# EAGLE design interface (EAGLE 9.6.2)

## Sheet 1 of 3: TITLE
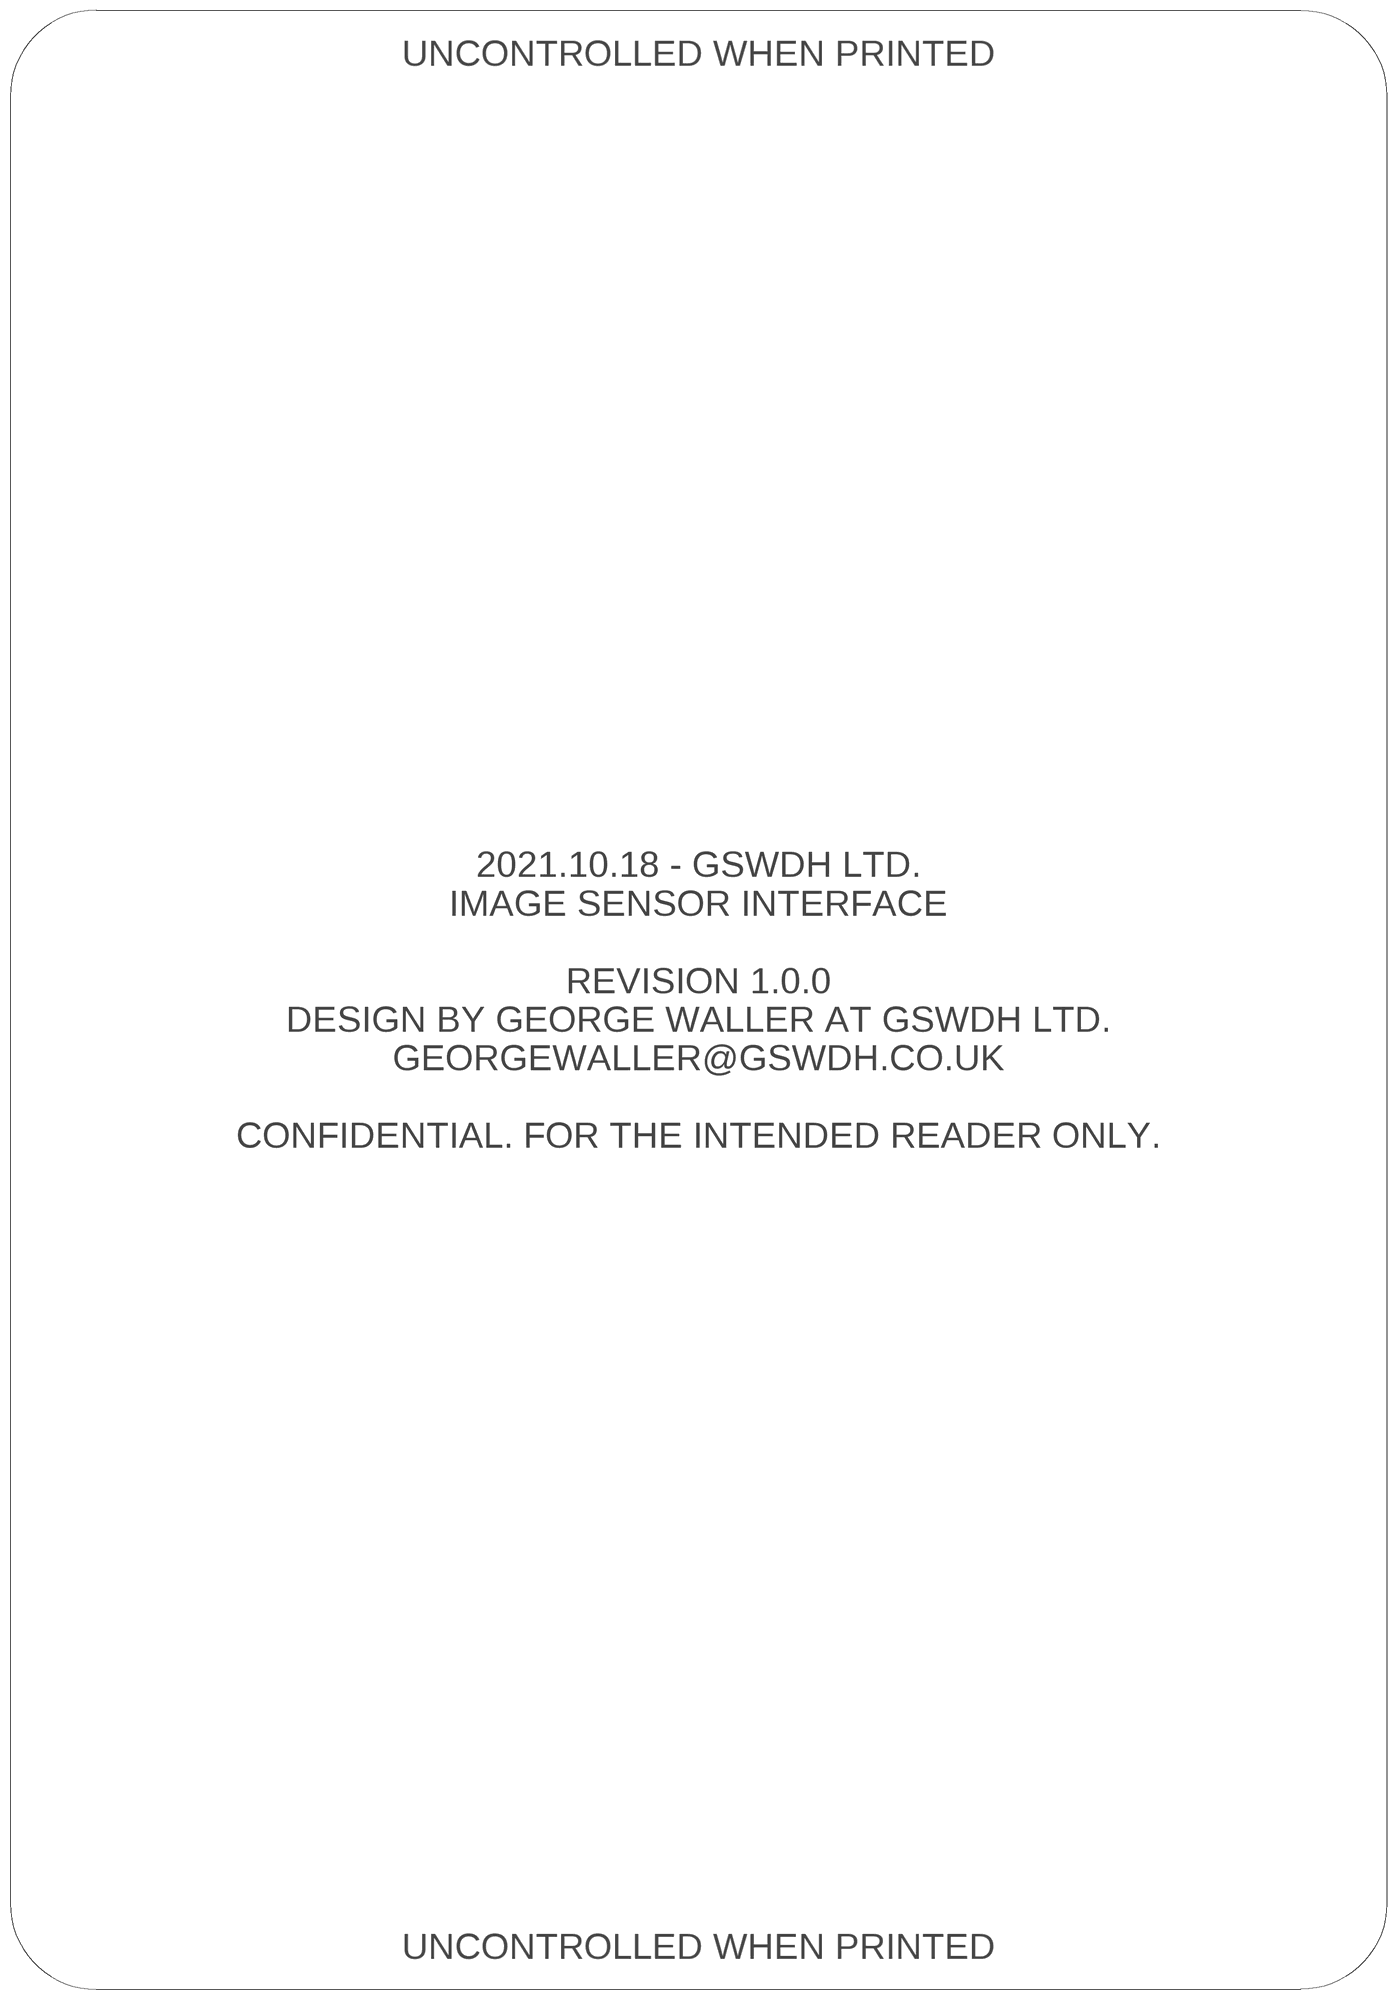
[diagram p0: schematic, sheet 1]

### Notes on the sheet
- UNCONTROLLED WHEN PRINTED
- 2021.10.18 - GSWDH LTD.
  IMAGE SENSOR INTERFACE
  
  REVISION 1.0.0
  DESIGN BY GEORGE WALLER AT GSWDH LTD.
  GEORGEWALLER@GSWDH.CO.UK
  
  CONFIDENTIAL. FOR THE INTENDED READER ONLY.
- UNCONTROLLED WHEN PRINTED

## Sheet 2 of 3: SENSOR
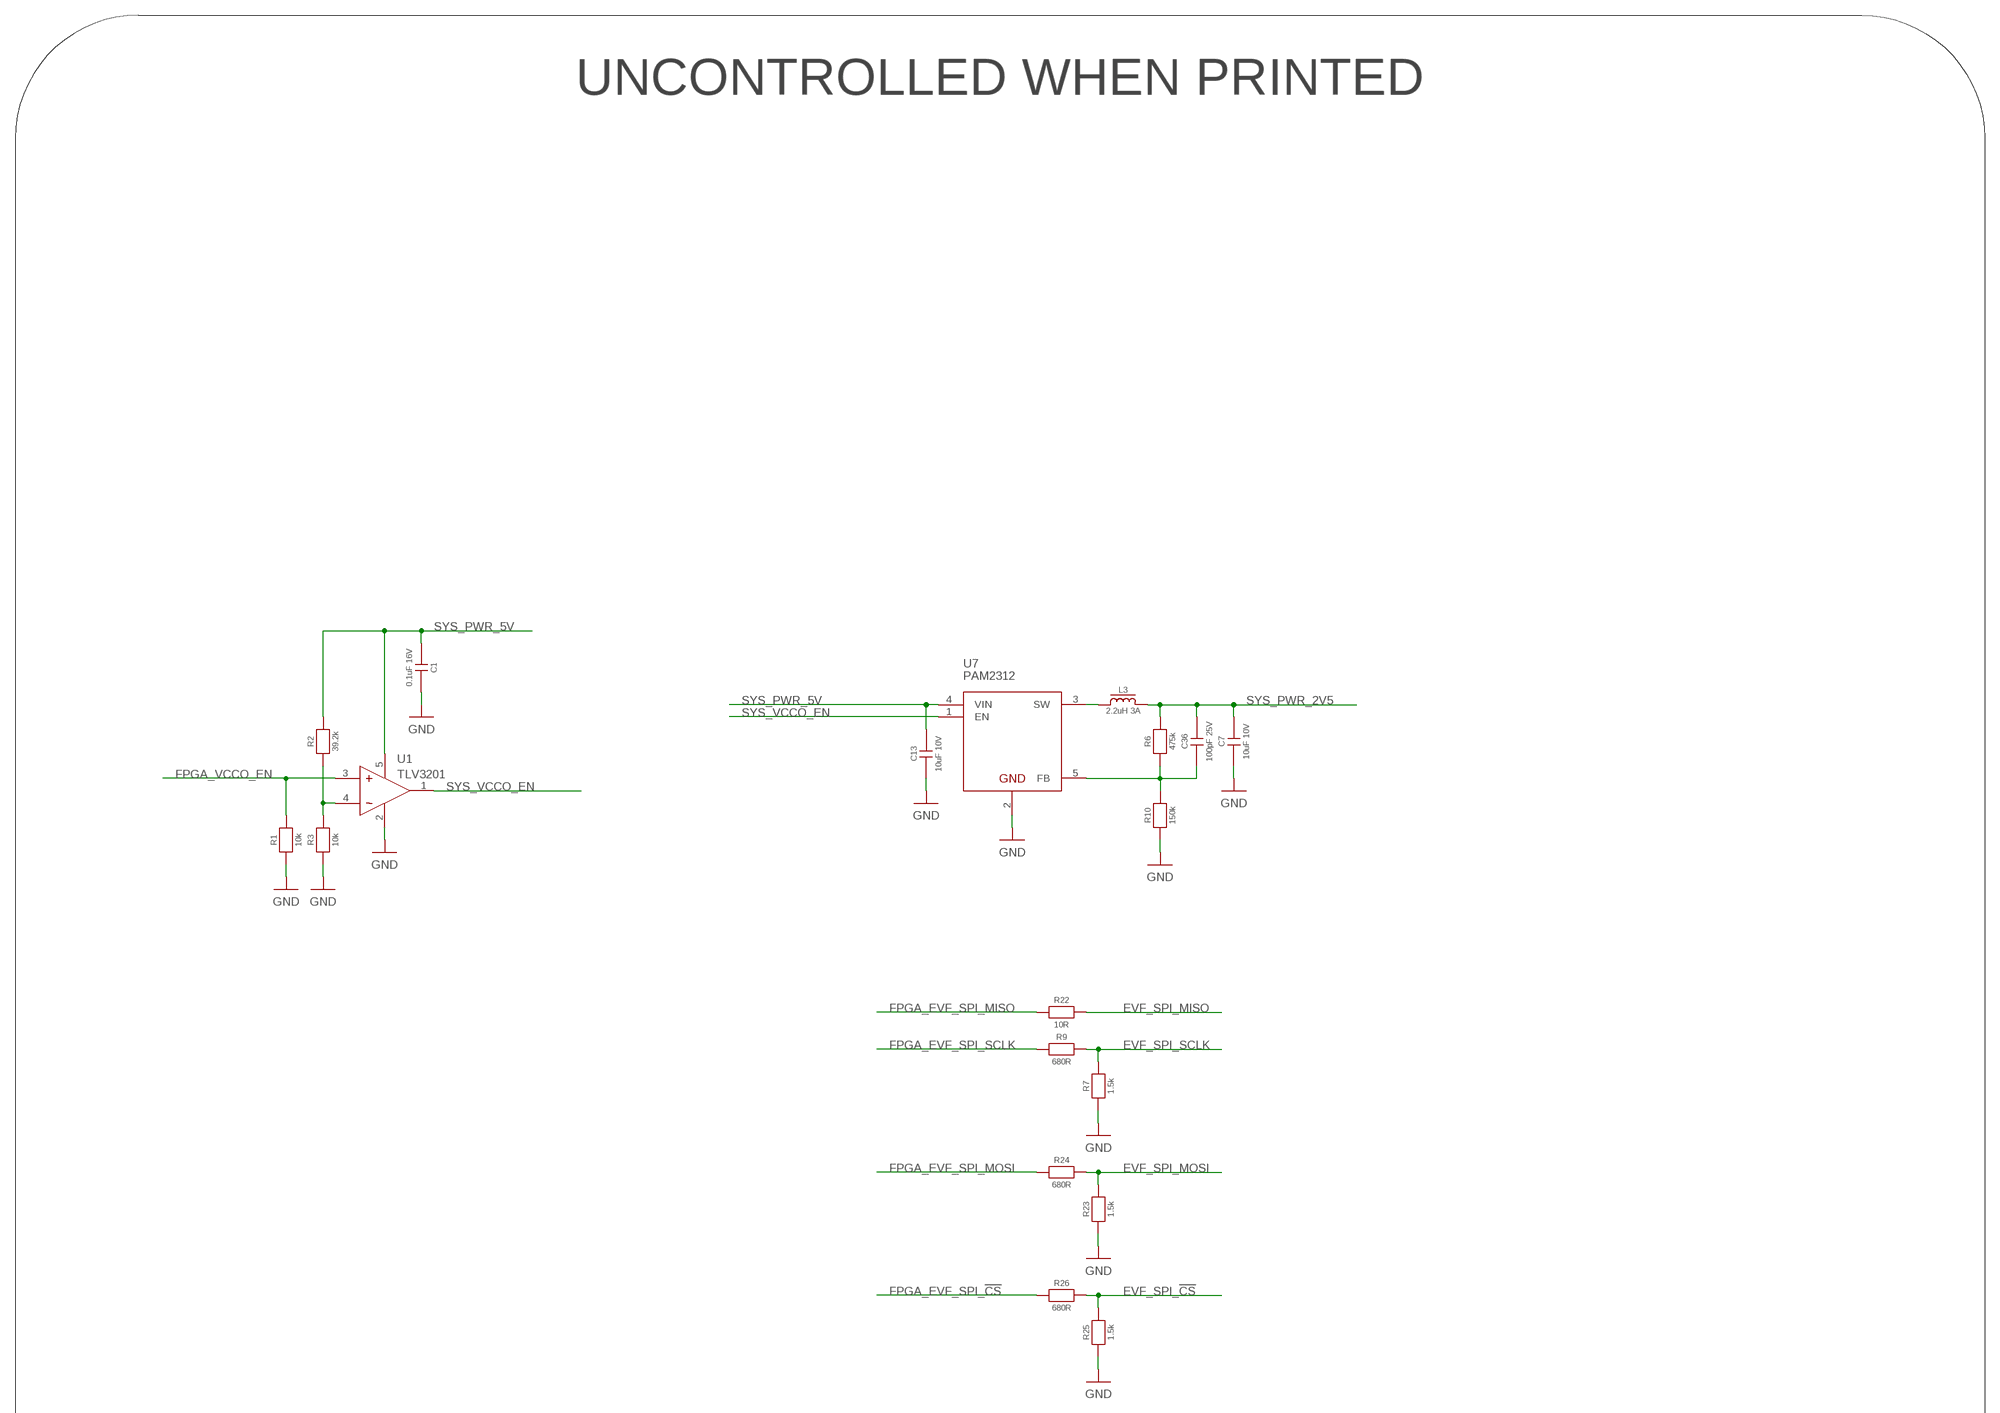
[diagram p1: schematic, sheet 2, part 1 of 2]
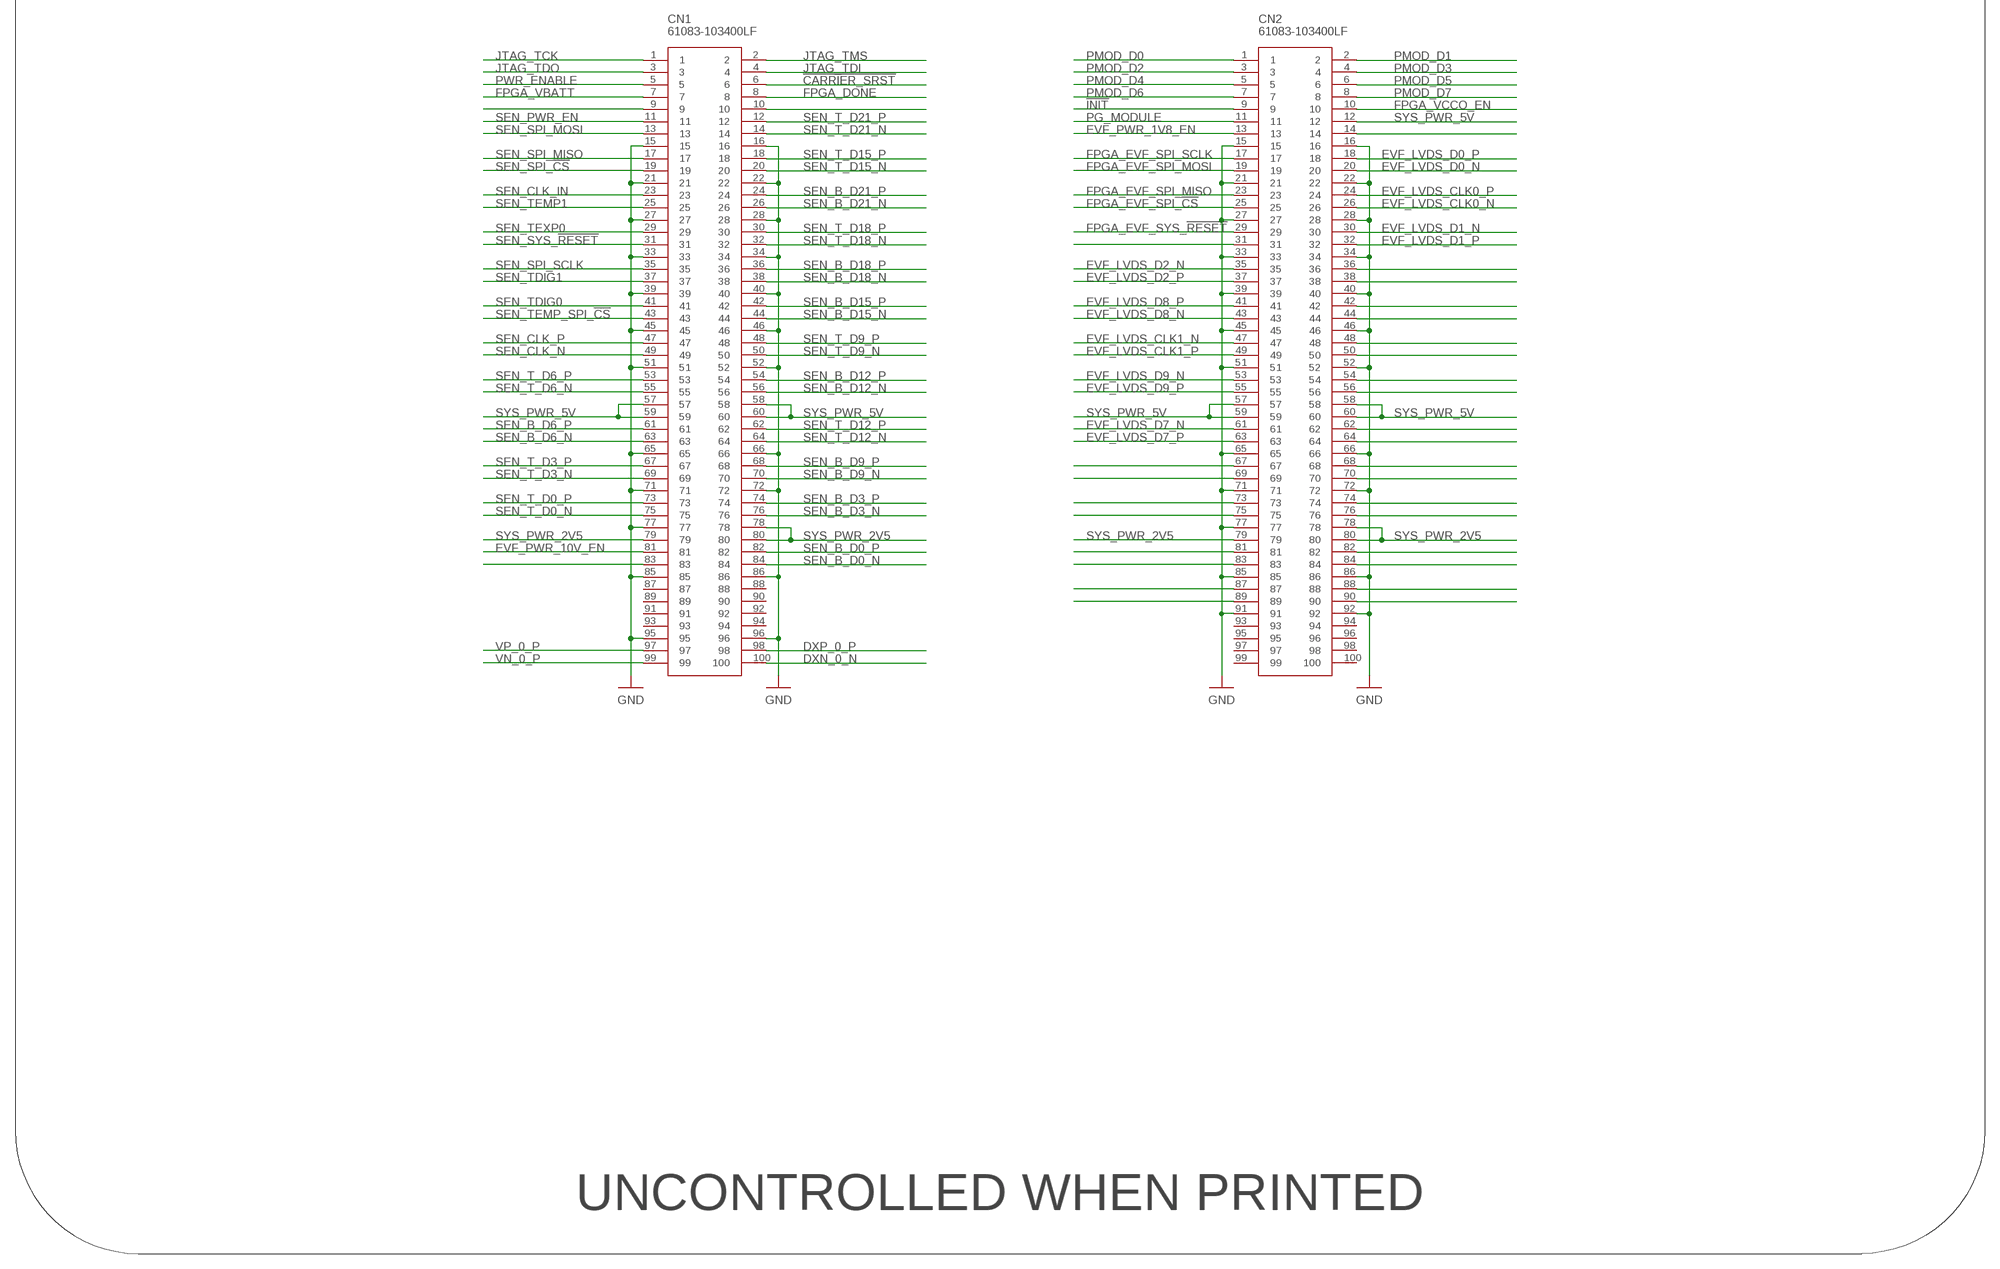
[diagram p2: schematic, sheet 2, part 2 of 2]

### Parts
C1  0.1uF 16V  C0603C104J4REC7867  [0603]
C7  10uF 10V  C1206C106K8PACTU  [1206]
C13  10uF 10V  C1206C106K8PACTU  [1206]
C36  100pF 25V  06033A101FAT2A  [0603]
CN1  61083-103400LF  [61083-103400LF]
CN2  61083-103400LF  [61083-103400LF]
L3  2.2uH 3A  IFSC1515AHER2R2M01  [IFSC-1515AH-01]
R1  10k  CRCW060310K0FKTA  [0603]
R2  39.2k  CRCW060339K2FKEA  [0603]
R3  10k  CRCW060310K0FKTA  [0603]
R6  475k  CRCW0603475KFKTA  [0603]
R7  1.5k  CRCW06031K50FKEB  [0603]
R9  680R  CRCW0603680RFKEB  [0603]
R10  150k  CRCW0603150KFKEB  [0603]
R22  10R  CRCW060310R0FKTA  [0603]
R23  1.5k  CRCW06031K50FKEB  [0603]
R24  680R  CRCW0603680RFKEB  [0603]
R25  1.5k  CRCW06031K50FKEB  [0603]
R26  680R  CRCW0603680RFKEB  [0603]
U1  TLV3201  TLV3201AIDBV  [SOT23-5]
U7  PAM2312  [SOT23-5]

### Nets
!CARRIER_SRST: CN1.6
!INIT: CN2.9
DXN_0_N: CN1.100
DXP_0_P: CN1.98
EVF_LVDS_CLK0_N: CN2.26 ; also sheet 3
EVF_LVDS_CLK0_P: CN2.24 ; also sheet 3
EVF_LVDS_CLK1_N: CN2.47 ; also sheet 3
EVF_LVDS_CLK1_P: CN2.49 ; also sheet 3
EVF_LVDS_D0_N: CN2.20 ; also sheet 3
EVF_LVDS_D0_P: CN2.18 ; also sheet 3
EVF_LVDS_D1_N: CN2.30 ; also sheet 3
EVF_LVDS_D1_P: CN2.32 ; also sheet 3
EVF_LVDS_D2_N: CN2.35 ; also sheet 3
EVF_LVDS_D2_P: CN2.37 ; also sheet 3
EVF_LVDS_D7_N: CN2.61 ; also sheet 3
EVF_LVDS_D7_P: CN2.63 ; also sheet 3
EVF_LVDS_D8_N: CN2.43 ; also sheet 3
EVF_LVDS_D8_P: CN2.41 ; also sheet 3
EVF_LVDS_D9_N: CN2.53 ; also sheet 3
EVF_LVDS_D9_P: CN2.55 ; also sheet 3
EVF_PWR_1V8_EN: CN2.13 ; also sheet 3
EVF_PWR_10V_EN: CN1.81 ; also sheet 3
EVF_SPI_!CS: R25.2 R26.2 ; also sheet 3
EVF_SPI_MISO: R22.2 ; also sheet 3
EVF_SPI_MOSI: R23.2 R24.2 ; also sheet 3
EVF_SPI_SCLK: R7.2 R9.2 ; also sheet 3
FPGA_DONE: CN1.8
FPGA_EVF_SPI_!CS: CN2.25 R26.1
FPGA_EVF_SPI_MISO: CN2.23 R22.1
FPGA_EVF_SPI_MOSI: CN2.19 R24.1
FPGA_EVF_SPI_SCLK: CN2.17 R9.1
FPGA_EVF_SYS_!RESET: CN2.29 ; also sheet 3
FPGA_VBATT: CN1.7
FPGA_VCCO_EN: CN2.10 R1.2 U1.3(+)
GND: C1.2 C7.1 C13.1 CN1.15 CN1.16 CN1.21 CN1.22 CN1.27 CN1.28 CN1.33 CN1.34 CN1.39 CN1.40 CN1.45 CN1.46 CN1.51 CN1.52 CN1.65 CN1.66 CN1.71 CN1.72 CN1.77 CN1.85 CN1.86 CN1.95 CN1.96 CN2.15 CN2.16 CN2.21 CN2.22 CN2.27 CN2.28 CN2.33 CN2.34 CN2.39 CN2.40 CN2.45 CN2.46 CN2.51 CN2.52 CN2.65 CN2.66 CN2.71 CN2.72 CN2.77 CN2.85 CN2.86 CN2.91 CN2.92 R1.1 R3.1 R7.1 R10.1 R23.1 R25.1 U1.2(GND) U7.2(GND) ; also sheet 3
JTAG_TCK: CN1.1
JTAG_TDI: CN1.4
JTAG_TDO: CN1.3
JTAG_TMS: CN1.2
N$2: R2.1 R3.2 U1.4(-)
N$3: CN2.31
N$13: CN1.9
N$14: L3.1 U7.3(SW)
N$15: C36.1 R6.1 R10.2 U7.5(FB)
N$37: CN1.83
N$48: CN1.10
N$98: CN2.67
N$99: CN2.69
N$100: CN2.73
N$101: CN2.75
N$102: CN2.81
N$103: CN2.83
N$104: CN2.87
N$105: CN2.89
N$116: CN2.14
N$125: CN2.36
N$126: CN2.38
N$127: CN2.42
N$128: CN2.44
N$129: CN2.48
N$130: CN2.50
N$131: CN2.54
N$132: CN2.56
N$133: CN2.62
N$134: CN2.64
N$135: CN2.68
N$136: CN2.70
N$137: CN2.74
N$138: CN2.76
N$139: CN2.82
N$140: CN2.84
N$141: CN2.88
N$142: CN2.90
PG_MODULE: CN2.11
PMOD_D0: CN2.1
PMOD_D1: CN2.2
PMOD_D2: CN2.3
PMOD_D3: CN2.4
PMOD_D4: CN2.5
PMOD_D5: CN2.6
PMOD_D6: CN2.7
PMOD_D7: CN2.8
PWR_ENABLE: CN1.5
SEN_B_D0_N: CN1.84 ; also sheet 3
SEN_B_D0_P: CN1.82 ; also sheet 3
SEN_B_D3_N: CN1.76 ; also sheet 3
SEN_B_D3_P: CN1.74 ; also sheet 3
SEN_B_D6_N: CN1.63 ; also sheet 3
SEN_B_D6_P: CN1.61 ; also sheet 3
SEN_B_D9_N: CN1.70 ; also sheet 3
SEN_B_D9_P: CN1.68 ; also sheet 3
SEN_B_D12_N: CN1.56 ; also sheet 3
SEN_B_D12_P: CN1.54 ; also sheet 3
SEN_B_D15_N: CN1.44 ; also sheet 3
SEN_B_D15_P: CN1.42 ; also sheet 3
SEN_B_D18_N: CN1.38 ; also sheet 3
SEN_B_D18_P: CN1.36 ; also sheet 3
SEN_B_D21_N: CN1.26 ; also sheet 3
SEN_B_D21_P: CN1.24 ; also sheet 3
SEN_CLK_IN: CN1.23 ; also sheet 3
SEN_CLK_N: CN1.49 ; also sheet 3
SEN_CLK_P: CN1.47 ; also sheet 3
SEN_PWR_EN: CN1.11 ; also sheet 3
SEN_SPI_!CS: CN1.19 ; also sheet 3
SEN_SPI_MISO: CN1.17 ; also sheet 3
SEN_SPI_MOSI: CN1.13 ; also sheet 3
SEN_SPI_SCLK: CN1.35 ; also sheet 3
SEN_SYS_!RESET: CN1.31 ; also sheet 3
SEN_T_D0_N: CN1.75 ; also sheet 3
SEN_T_D0_P: CN1.73 ; also sheet 3
SEN_T_D3_N: CN1.69 ; also sheet 3
SEN_T_D3_P: CN1.67 ; also sheet 3
SEN_T_D6_N: CN1.55 ; also sheet 3
SEN_T_D6_P: CN1.53 ; also sheet 3
SEN_T_D9_N: CN1.50 ; also sheet 3
SEN_T_D9_P: CN1.48 ; also sheet 3
SEN_T_D12_N: CN1.64 ; also sheet 3
SEN_T_D12_P: CN1.62 ; also sheet 3
SEN_T_D15_N: CN1.20 ; also sheet 3
SEN_T_D15_P: CN1.18 ; also sheet 3
SEN_T_D18_N: CN1.32 ; also sheet 3
SEN_T_D18_P: CN1.30 ; also sheet 3
SEN_T_D21_N: CN1.14 ; also sheet 3
SEN_T_D21_P: CN1.12 ; also sheet 3
SEN_TDIG0: CN1.41 ; also sheet 3
SEN_TDIG1: CN1.37 ; also sheet 3
SEN_TEMP1: CN1.25 ; also sheet 3
SEN_TEMP_SPI_!CS: CN1.43 ; also sheet 3
SEN_TEXP0: CN1.29 ; also sheet 3
SYS_PWR_2V5: C7.2 C36.2 CN1.78 CN1.79 CN1.80 CN2.78 CN2.79 CN2.80 L3.2 R6.2 ; also sheet 3
SYS_PWR_5V: C1.1 C13.2 CN1.57 CN1.58 CN1.59 CN1.60 CN2.12 CN2.57 CN2.58 CN2.59 CN2.60 R2.2 U1.5(VCC) U7.4(VIN) ; also sheet 3
SYS_VCCO_EN: U1.1(VOUT) U7.1(EN)
VN_0_P: CN1.99
VP_0_P: CN1.97
Unconnected: CN1.87 CN1.88 CN1.89 CN1.90 CN1.91 CN1.92 CN1.93 CN1.94 CN2.93 CN2.94 CN2.95 CN2.96 CN2.97 CN2.98 CN2.99 CN2.100

### Notes on the sheet
- UNCONTROLLED WHEN PRINTED
- UNCONTROLLED WHEN PRINTED

## Sheet 3 of 3
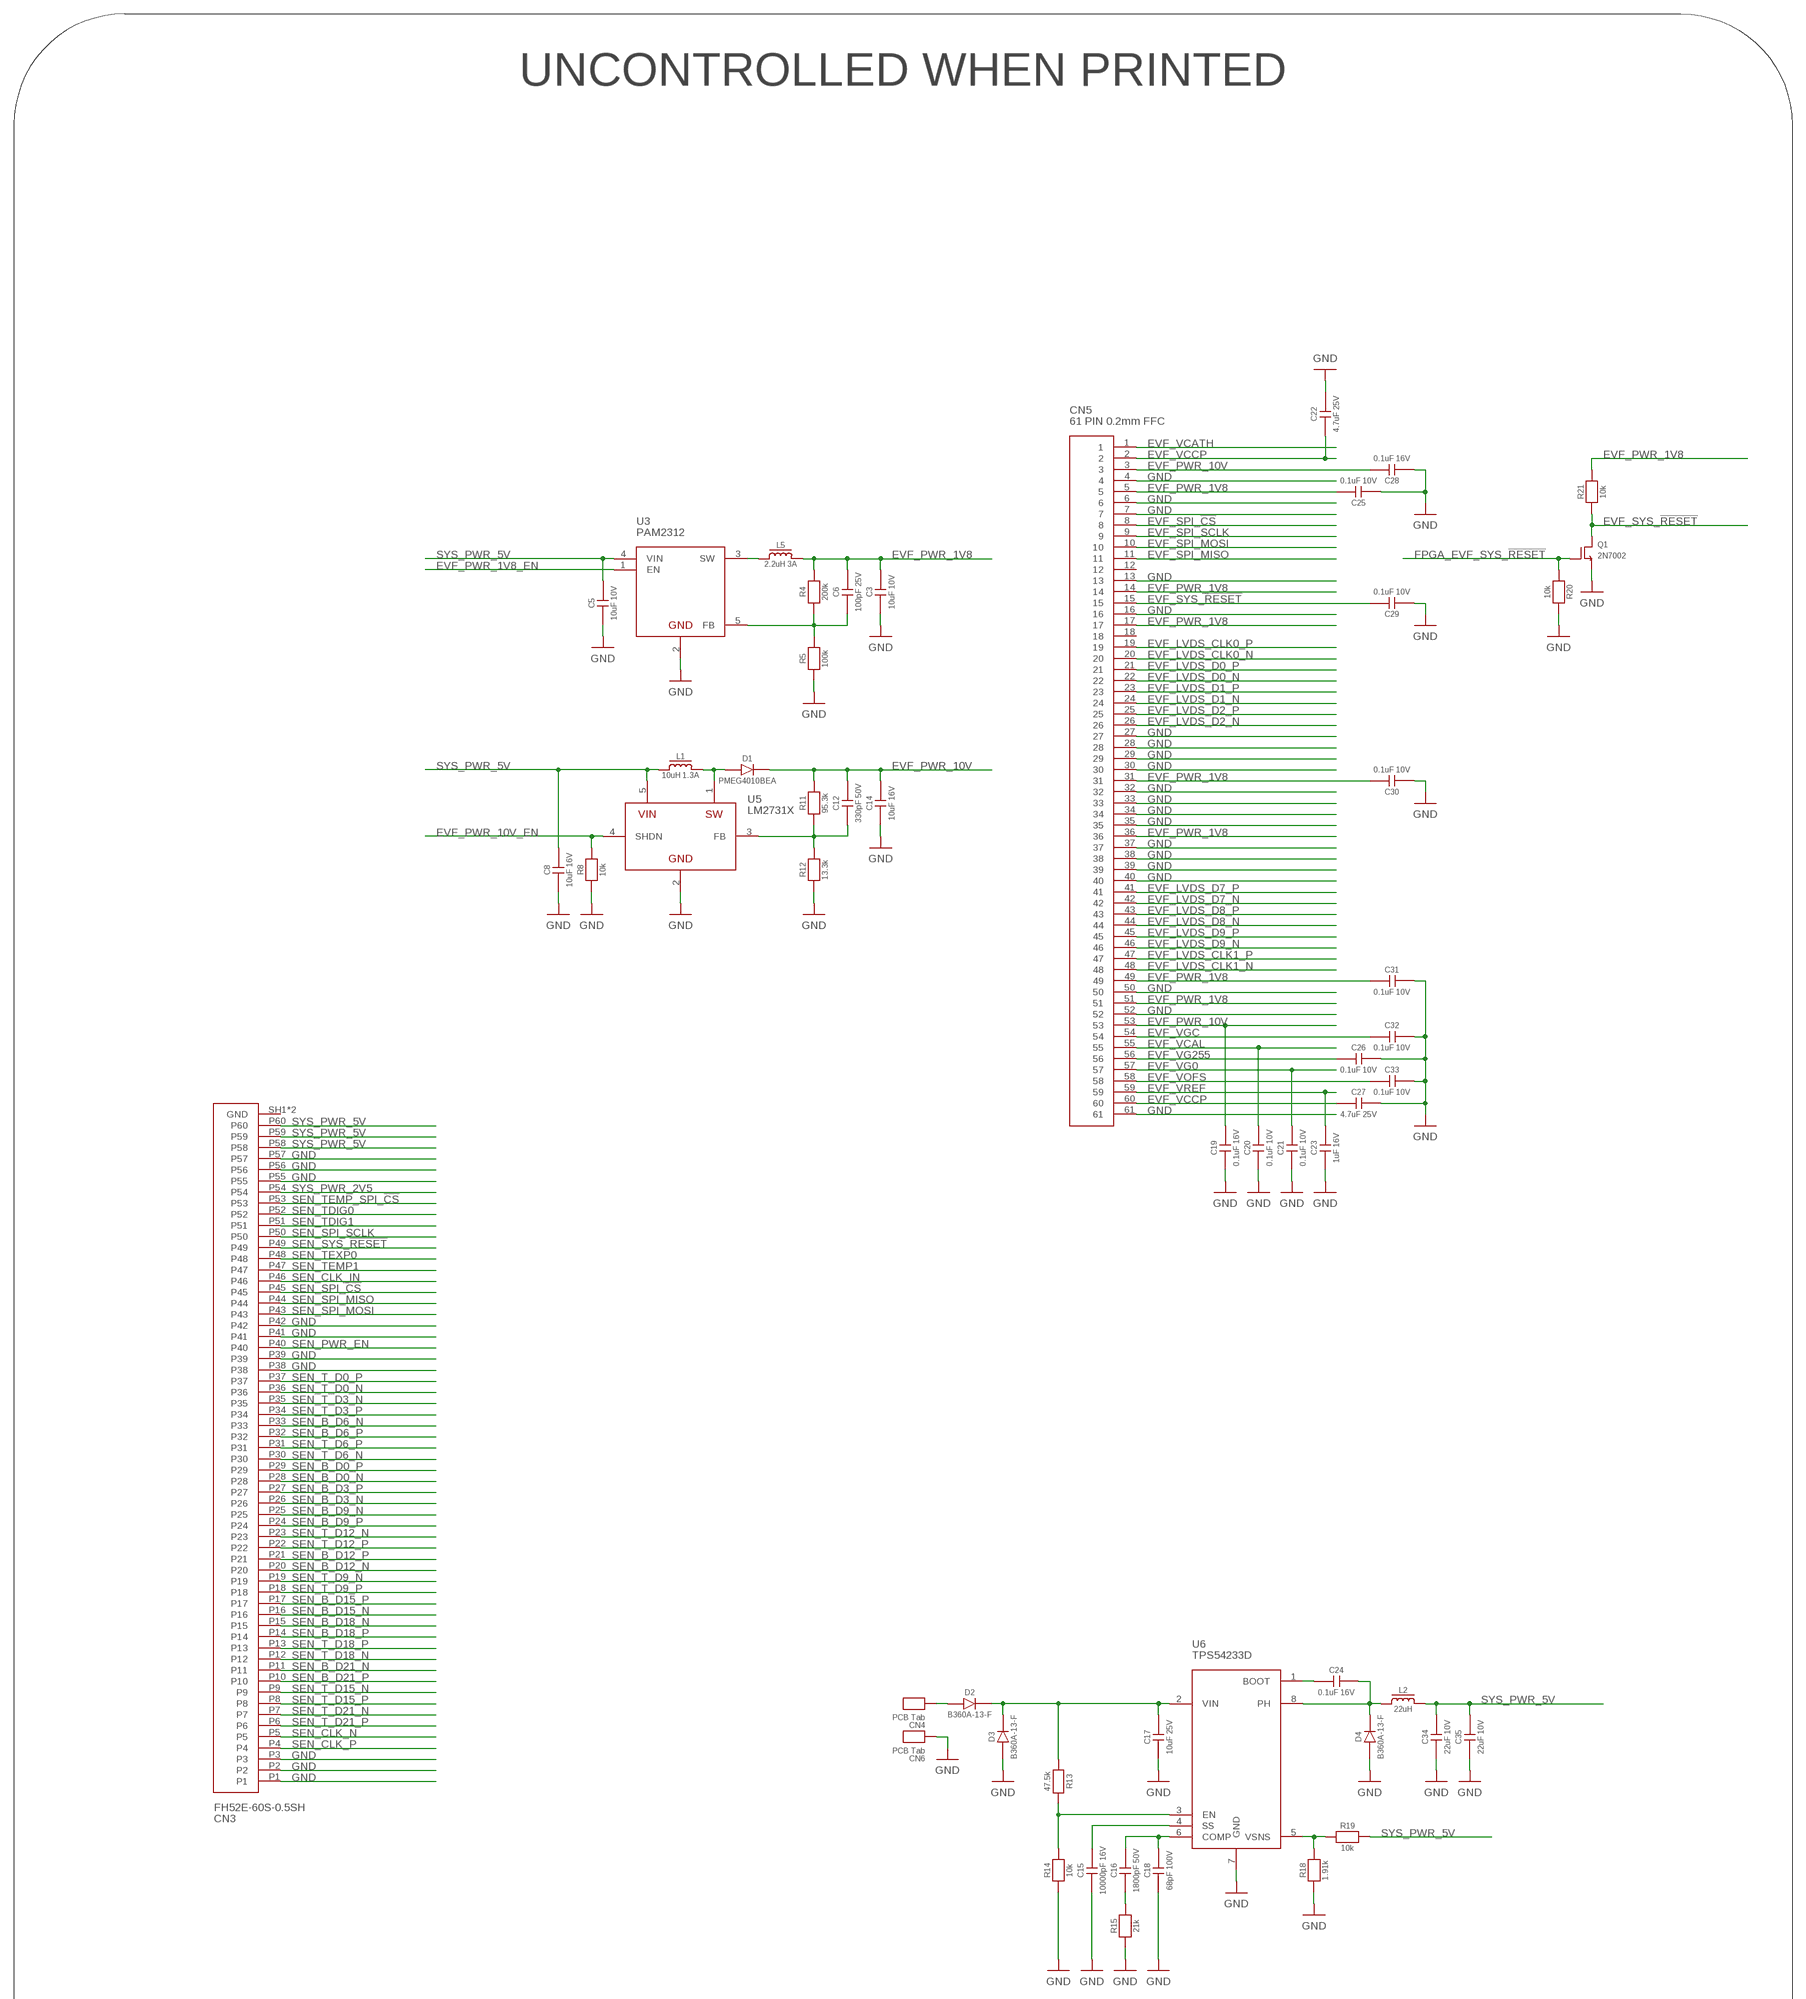
[diagram p3: schematic, sheet 3, part 1 of 2]
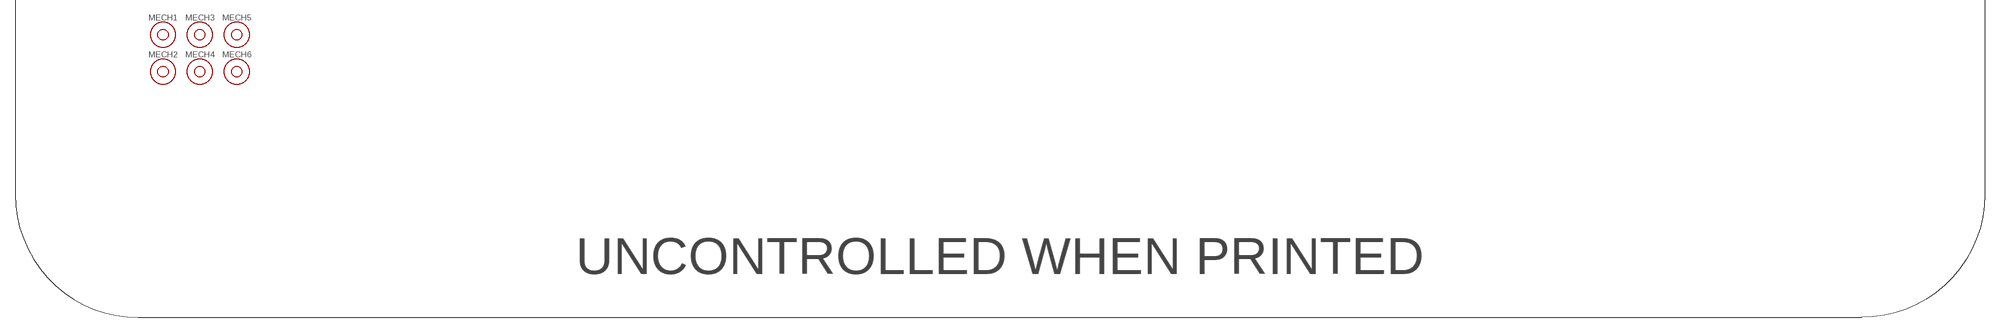
[diagram p4: schematic, sheet 3, part 2 of 2]

### Parts
C3  10uF 10V  C1206C106K8PACTU  [1206]
C5  10uF 10V  C1206C106K8PACTU  [1206]
C6  100pF 25V  06033A101FAT2A  [0603]
C8  10uF 16V  C1206C106K4PAC7210  [1206]
C12  330pF 50V  C0603C331J5GACTU  [0603]
C14  10uF 16V  C1206C106K4PAC7210  [1206]
C15  10000pF 16V  C0603C103K4REC7867  [0603]
C16  1800pF 50V  06035C182JAT2A  [0603]
C17  10uF 25V  C1206C106K3PACTU  [1206]
C18  68pF 100V  06031A680JAT2A  [0603]
C19  0.1uF 16V  C0603C104K4RAC7411  [0603]
C20  0.1uF 10V  0402ZC104KAT2A  [0402]
C21  0.1uF 10V  0402ZC104KAT2A  [0402]
C22  4.7uF 25V  CL10A475KA8NQNC  [0603]
C23  1uF 16V  CL10B105KO8VPNC  [0603]
C24  0.1uF 16V  C0603C104K4RAC7411  [0603]
C25  0.1uF 10V  0402ZC104KAT2A  [0402]
C26  0.1uF 10V  0402ZC104KAT2A  [0402]
C27  4.7uF 25V  CL10A475KA8NQNC  [0603]
C28  0.1uF 16V  C0603C104K4RAC7411  [0603]
C29  0.1uF 10V  0402ZC104KAT2A  [0402]
C30  0.1uF 10V  0402ZC104KAT2A  [0402]
C31  0.1uF 10V  0402ZC104KAT2A  [0402]
C32  0.1uF 10V  0402ZC104KAT2A  [0402]
C33  0.1uF 10V  0402ZC104KAT2A  [0402]
C34  22uF 10V  C1206C226K8RAC7210  [1206]
C35  22uF 10V  C1206C226K8RAC7210  [1206]
CN3  FH52E-60S-0.5SH  [FH52E-60S-0.5SH]
CN4  PCB Tab  PCB_TAB_SMALL  [PCB_TAB_SMALL]
CN5  61 PIN 0.2mm FFC  046866761000846+  [046866761000846+]
CN6  PCB Tab  PCB_TAB_SMALL  [PCB_TAB_SMALL]
D1  PMEG4010BEA  [SOD-323]
D2  B360A-13-F  [DO214AC]
D3  B360A-13-F  [DO214AC]
D4  B360A-13-F  [DO214AC]
L1  10uH 1.3A  IFSC1515AHER100M01  [IFSC-1515AH-01]
L2  22uH  ECS-MPIL0630-220MC  [ECS-MPIL0630]
L5  2.2uH 3A  IFSC1515AHER2R2M01  [IFSC-1515AH-01]
MECH1  6mm x 3mm  MOUNTHOLE  [MOUNTHOLE_6X3]
MECH2  6mm x 3mm  MOUNTHOLE  [MOUNTHOLE_6X3]
MECH3  6mm x 3mm  MOUNTHOLE  [MOUNTHOLE_6X3]
MECH4  6mm x 3mm  MOUNTHOLE  [MOUNTHOLE_6X3]
MECH5  6mm x 3mm  MOUNTHOLE  [MOUNTHOLE_6X3]
MECH6  6mm x 3mm  MOUNTHOLE  [MOUNTHOLE_6X3]
Q1  2N7002  2N7002P,215  [SOT23-3]
R4  200k  CRCW0603200KFKEB  [0603]
R5  100k  CRCW0603100KFKEB  [0603]
R8  10k  CRCW060310K0FKTA  [0603]
R11  95.3k  CRCW060395K3FKEA  [0603]
R12  13.3k  CRCW060313K3FKEB  [0603]
R13  47.5k  CRCW060347K5FKEA  [0603]
R14  10k  CRCW060310K0FKTA  [0603]
R15  21k  CRCW060321K0FKEA  [0603]
R18  1.91k  CRCW06031K91FKEA  [0603]
R19  10k  CRCW060310K0FKTA  [0603]
R20  10k  CRCW060310K0FKTA  [0603]
R21  10k  CRCW060310K0FKTA  [0603]
U3  PAM2312  [SOT23-5]
U5  LM2731X  LM2731XMF  [SOT23-5]
U6  TPS54233D  [SO8]

### Nets
EVF_LVDS_CLK0_N: CN5.20 ; also sheet 2
EVF_LVDS_CLK0_P: CN5.19 ; also sheet 2
EVF_LVDS_CLK1_N: CN5.48 ; also sheet 2
EVF_LVDS_CLK1_P: CN5.47 ; also sheet 2
EVF_LVDS_D0_N: CN5.22 ; also sheet 2
EVF_LVDS_D0_P: CN5.21 ; also sheet 2
EVF_LVDS_D1_N: CN5.24 ; also sheet 2
EVF_LVDS_D1_P: CN5.23 ; also sheet 2
EVF_LVDS_D2_N: CN5.26 ; also sheet 2
EVF_LVDS_D2_P: CN5.25 ; also sheet 2
EVF_LVDS_D7_N: CN5.42 ; also sheet 2
EVF_LVDS_D7_P: CN5.41 ; also sheet 2
EVF_LVDS_D8_N: CN5.44 ; also sheet 2
EVF_LVDS_D8_P: CN5.43 ; also sheet 2
EVF_LVDS_D9_N: CN5.46 ; also sheet 2
EVF_LVDS_D9_P: CN5.45 ; also sheet 2
EVF_PWR_1V8: C3.2 C6.2 C25.2 C30.2 C31.1 CN5.5 CN5.14 CN5.17 CN5.31 CN5.36 CN5.49 CN5.51 L5.2 R4.2 R21.2
EVF_PWR_1V8_EN: U3.1(EN) ; also sheet 2
EVF_PWR_10V: C12.2 C14.2 C19.2 C28.2 CN5.3 CN5.53 D1.K R11.2
EVF_PWR_10V_EN: R8.2 U5.4(SHDN) ; also sheet 2
EVF_SPI_!CS: CN5.8 ; also sheet 2
EVF_SPI_MISO: CN5.11 ; also sheet 2
EVF_SPI_MOSI: CN5.10 ; also sheet 2
EVF_SPI_SCLK: CN5.9 ; also sheet 2
EVF_SYS_!RESET: C29.2 CN5.15 Q1.2(D) R21.1
EVF_VCAL: C20.2 CN5.55
EVF_VCATH: CN5.1
EVF_VCCP: C22.1 C27.1 CN5.2 CN5.60
EVF_VG0: C21.2 CN5.57
EVF_VG255: C26.1 CN5.56
EVF_VGC: C32.1 CN5.54
EVF_VOFS: C33.1 CN5.58
EVF_VREF: C23.2 CN5.59
FPGA_EVF_SYS_!RESET: Q1.1(G) R20.1 ; also sheet 2
GND: C3.1 C5.1 C8.1 C14.1 C15.1 C17.1 C18.1 C19.1 C20.1 C21.1 C22.2 C23.1 C25.1 C26.2 C27.2 C28.1 C29.1 C30.1 C31.2 C32.2 C33.2 C34.1 C35.1 CN3.P1 CN3.P2 CN3.P3 CN3.P38 CN3.P39 CN3.P41 CN3.P42 CN3.P55 CN3.P56 CN3.P57 CN5.4 CN5.6 CN5.7 CN5.13 CN5.16 CN5.27 CN5.28 CN5.29 CN5.30 CN5.32 CN5.33 CN5.34 CN5.35 CN5.37 CN5.38 CN5.39 CN5.40 CN5.50 CN5.52 CN5.61 CN6.1 D3.A D4.A Q1.3(S) R5.1 R8.1 R12.1 R14.1 R15.1 R18.1 R20.2 U3.2(GND) U5.2(GND) U6.7(GND) ; also sheet 2
N$4: C24.1 D4.K L2.1 U6.8(PH)
N$5: C24.2 U6.1(BOOT)
N$6: C17.2 D2.K D3.K R13.2 U6.2(VIN)
N$7: R13.1 R14.2 U6.3(EN)
N$8: R18.2 R19.1 U6.5(VSNS)
N$9: C16.2 C18.2 U6.6(COMP)
N$10: C16.1 R15.2
N$11: C15.2 U6.4(SS)
N$12: CN4.1 D2.A
N$17: L5.1 U3.3(SW)
N$18: C6.1 R4.1 R5.2 U3.5(FB)
N$119: D1.A L1.2 U5.1(SW)
N$121: C12.1 R11.1 R12.2 U5.3(FB)
SEN_B_D0_N: CN3.P28 ; also sheet 2
SEN_B_D0_P: CN3.P29 ; also sheet 2
SEN_B_D3_N: CN3.P26 ; also sheet 2
SEN_B_D3_P: CN3.P27 ; also sheet 2
SEN_B_D6_N: CN3.P33 ; also sheet 2
SEN_B_D6_P: CN3.P32 ; also sheet 2
SEN_B_D9_N: CN3.P25 ; also sheet 2
SEN_B_D9_P: CN3.P24 ; also sheet 2
SEN_B_D12_N: CN3.P20 ; also sheet 2
SEN_B_D12_P: CN3.P21 ; also sheet 2
SEN_B_D15_N: CN3.P16 ; also sheet 2
SEN_B_D15_P: CN3.P17 ; also sheet 2
SEN_B_D18_N: CN3.P15 ; also sheet 2
SEN_B_D18_P: CN3.P14 ; also sheet 2
SEN_B_D21_N: CN3.P11 ; also sheet 2
SEN_B_D21_P: CN3.P10 ; also sheet 2
SEN_CLK_IN: CN3.P46 ; also sheet 2
SEN_CLK_N: CN3.P5 ; also sheet 2
SEN_CLK_P: CN3.P4 ; also sheet 2
SEN_PWR_EN: CN3.P40 ; also sheet 2
SEN_SPI_!CS: CN3.P45 ; also sheet 2
SEN_SPI_MISO: CN3.P44 ; also sheet 2
SEN_SPI_MOSI: CN3.P43 ; also sheet 2
SEN_SPI_SCLK: CN3.P50 ; also sheet 2
SEN_SYS_!RESET: CN3.P49 ; also sheet 2
SEN_T_D0_N: CN3.P36 ; also sheet 2
SEN_T_D0_P: CN3.P37 ; also sheet 2
SEN_T_D3_N: CN3.P35 ; also sheet 2
SEN_T_D3_P: CN3.P34 ; also sheet 2
SEN_T_D6_N: CN3.P30 ; also sheet 2
SEN_T_D6_P: CN3.P31 ; also sheet 2
SEN_T_D9_N: CN3.P19 ; also sheet 2
SEN_T_D9_P: CN3.P18 ; also sheet 2
SEN_T_D12_N: CN3.P23 ; also sheet 2
SEN_T_D12_P: CN3.P22 ; also sheet 2
SEN_T_D15_N: CN3.P9 ; also sheet 2
SEN_T_D15_P: CN3.P8 ; also sheet 2
SEN_T_D18_N: CN3.P12 ; also sheet 2
SEN_T_D18_P: CN3.P13 ; also sheet 2
SEN_T_D21_N: CN3.P7 ; also sheet 2
SEN_T_D21_P: CN3.P6 ; also sheet 2
SEN_TDIG0: CN3.P52 ; also sheet 2
SEN_TDIG1: CN3.P51 ; also sheet 2
SEN_TEMP1: CN3.P47 ; also sheet 2
SEN_TEMP_SPI_!CS: CN3.P53 ; also sheet 2
SEN_TEXP0: CN3.P48 ; also sheet 2
SYS_PWR_2V5: CN3.P54 ; also sheet 2
SYS_PWR_5V: C5.2 C8.2 C34.2 C35.2 CN3.P58 CN3.P59 CN3.P60 L1.1 L2.2 R19.2 U3.4(VIN) U5.5(VIN) ; also sheet 2
Unconnected: CN3.SH1(GND) CN3.SH3(GND) CN5.12 CN5.18

### Notes on the sheet
- UNCONTROLLED WHEN PRINTED
- UNCONTROLLED WHEN PRINTED

## Library data of the parts
C1 = c_0603:C0603C104J4REC7867: 100000 16V 0.1µF ±5% X7R 0603; DIGIKEY: 399-C0603C104J4REC7867CT-ND; HEIGHT: -; MANUFACTURER: KEMET; PRICE_PER: 0.12000; STOCK: 8607; TEMP_CO: X7R; TOLERANCE: ±5%; VOLTAGE: 16V
C3 C5 C7 C13 = c_1206:C1206C106K8PACTU: 10000000 10V 10µF ±10% X5R 1206; DIGIKEY: 399-8152-1-ND; HEIGHT: -; MANUFACTURER: KEMET; PRICE_PER: 0.26000; STOCK: 8489; TEMP_CO: X5R; TOLERANCE: ±10%; VOLTAGE: 10V
C6 C36 = c_0603:06033A101FAT2A: 100 25V 100pF ±1% C0G, NP0 0603; DIGIKEY: 478-06033A101FAT2ACT-ND; HEIGHT: -; MANUFACTURER: AVX Corporation; PRICE_PER: 0.36000; STOCK: 17245; TEMP_CO: C0G, NP0; TOLERANCE: ±1%; VOLTAGE: 25V
C8 C14 = c_1206:C1206C106K4PAC7210: 10000000 16V 10µF ±10% X5R 1206; DIGIKEY: 399-C1206C106K4PAC7210CT-ND; HEIGHT: -; MANUFACTURER: KEMET; PRICE_PER: 0.23000; STOCK: 5709; TEMP_CO: X5R; TOLERANCE: ±10%; VOLTAGE: 16V
C12 = c_0603:C0603C331J5GACTU: 330 50V 330pF ±5% C0G, NP0 0603; DIGIKEY: 399-C0603C331J5GAC7867CT-ND; HEIGHT: -; MANUFACTURER: KEMET; PRICE_PER: 0.07000; STOCK: 307288; TEMP_CO: C0G, NP0; TOLERANCE: ±5%; VOLTAGE: 50V
C15 = c_0603:C0603C103K4REC7867: 10000 16V 10000pF ±10% X7R 0603; DIGIKEY: 399-C0603C103K4REC7867CT-ND; HEIGHT: -; MANUFACTURER: KEMET; PRICE_PER: 0.09000; STOCK: 5656; TEMP_CO: X7R; TOLERANCE: ±10%; VOLTAGE: 16V
C16 = c_0603:06035C182JAT2A: 1800 50V 1800pF ±5% X7R 0603; DIGIKEY: 478-12721-1-ND; HEIGHT: -; MANUFACTURER: AVX Corporation; PRICE_PER: 0.08000; STOCK: 23693; TEMP_CO: X7R; TOLERANCE: ±5%; VOLTAGE: 50V
C17 = c_1206:C1206C106K3PACTU: 10000000 25V 10µF ±10% X5R 1206; DIGIKEY: 399-6784-1-ND; HEIGHT: -; MANUFACTURER: KEMET; PRICE_PER: 0.28000; STOCK: 138; TEMP_CO: X5R; TOLERANCE: ±10%; VOLTAGE: 25V
C18 = c_0603:06031A680JAT2A: 68 100V 68pF ±5% C0G, NP0 0603; DIGIKEY: 478-1145-1-ND; HEIGHT: -; MANUFACTURER: AVX Corporation; PRICE_PER: 0.11000; STOCK: 10599; TEMP_CO: C0G, NP0; TOLERANCE: ±5%; VOLTAGE: 100V
C19 C24 C28 = c_0603:C0603C104K4RAC7411: 100000 16V 0.1µF ±10% X7R 0603; DIGIKEY: 399-17393-1-ND; HEIGHT: -; MANUFACTURER: KEMET; PRICE_PER: 0.08000; STOCK: 95457; TEMP_CO: X7R; TOLERANCE: ±10%; VOLTAGE: 16V
C20 C21 C25 C26 C29-C33 = c_0402:0402ZC104KAT2A: 100000 10V 0.1µF ±10% X7R 0402; DIGIKEY: 478-7891-1-ND; HEIGHT: -; MANUFACTURER: AVX Corporation; PRICE_PER: 0.07000; STOCK: 639; TEMP_CO: X7R; TOLERANCE: ±10%; VOLTAGE: 10V
C22 C27 = c_0603:CL10A475KA8NQNC: 4700000 25V 4.7µF ±10% X5R 0603; DIGIKEY: 1276-1900-1-ND; HEIGHT: -; MANUFACTURER: Samsung Electro-Mechanics; PRICE_PER: 0.27000; STOCK: 172474; TEMP_CO: X5R; TOLERANCE: ±10%; VOLTAGE: 25V
C23 = c_0603:CL10B105KO8VPNC: 1000000 16V 1µF ±10% X7R 0603; DIGIKEY: 1276-6613-1-ND; HEIGHT: -; MANUFACTURER: Samsung Electro-Mechanics; PRICE_PER: 0.13000; STOCK: 833279; TEMP_CO: X7R; TOLERANCE: ±10%; VOLTAGE: 16V
C34 C35 = c_1206:C1206C226K8RAC7210: 22000000 10V 22µF ±10% X7R 1206; DIGIKEY: 399-C1206C226K8RAC7210CT-ND; HEIGHT: -; MANUFACTURER: KEMET; PRICE_PER: 0.54000; STOCK: 4346; TEMP_CO: X7R; TOLERANCE: ±10%; VOLTAGE: 10V
CN1 CN2 = CONNECTORs:61083-103400LF: 100 Position Connector Plug, Center Strip Contacts Surface Mount Gold; DIGIKEY: 609-5948-ND; HEIGHT: 6.7; PRICE_PER: 4.15
CN3 = CONNECTORs:FH52E-60S-0.5SH: 60 Position FFC, FPC Connector Contacts, Bottom 0.020" (0.50mm) Surface Mount, Right Angle; DIGIKEY: H125289CT-ND; HEIGHT: 2; PRICE_PER: 4.41
CN4 CN6 = CONNECTORs:PCB_TAB_SMALL: PCB tab for soldering. Built into the PCB.; HEIGHT: 2; PRICE_PER: 0
CN5 = CONNECTORs:046866761000846+: 61 Position FPC Connector Contacts, Bottom 0.008" (0.20mm) Surface Mount, Right Angle; DIGIKEY: 1253-046866761000846+CT-ND; HEGHT: 1; PRICE_PER: 1.51
D1 = DIODES:PMEG4010BEA: 1A, 40V Schottkey rectifier. SOD323.; DIGIKEY: 1727-5211-1-ND; HEIGHT: 1.2; PRICE_PER: 0.29
D2-D4 = DIODES:B360A-13-F: Schottky Rectifier, 60 V, 3 A, Single, DO-214AC, 2 Pins, 700 mV; DIGIKEY: B360A-FDICT-ND; HEIGHT: 2; PRICE_PER: 0.31
L1 = INDUCTORS:IFSC1515AHER100M01: Surface Mount Power Inductor, IFSC-1515AH-01 Series, 10 µH, ± 20%, Shielded, 0.17 ohm, 1.3 A; DIGIKEY: 541-1406-1-ND; HEIGHT: 2; PRICE_PER: 0.42
L2 = INDUCTORS:ECS-MPIL0630-220MC: FIXED IND 22UH 3A 135 MOHM SMD; DIGIKEY: XC2409CT-ND; HEIGHT: 3; PRICE_PER: 0.73
L3 L5 = INDUCTORS:IFSC1515AHER2R2M01: INDUCTOR, 2.2UH, 3A, 20%, 5MHZ; DIGIKEY: 541-1404-1-ND; HEIGHT: 2; PRICE_PER: 0.377
MECH1-MECH6 = MISC:MOUNTHOLE: Mechanical mounting hole.
Q1 = TRANSISTORs:2N7002: N-Channel 60V 360mA (Ta) 350mW (Ta) Surface Mount TO-236AB (SOT23); DIGIKEY: 1727-4692-1-ND; HEIGHT: 1; PRICE_PER: 0.15
R1 R3 R8 R14 R19-R21 = r_0603:CRCW060310K0FKTA: 10000 ±1% 10k Thick Film 0.1W, 1/10W 0603; DIGIKEY: 541-2980-1-ND; HEIGHT: 1; MANUFACTURER: Vishay Dale; POWER: 0.1W, 1/10W; PRICE_PER: 0.12000; STOCK: 50797; TOLERANCE: ±1%
R2 = r_0603:CRCW060339K2FKEA: 39200 ±1% 39.2k Thick Film 0.1W, 1/10W 0603; DIGIKEY: 541-39.2KHCT-ND; HEIGHT: 1; MANUFACTURER: Vishay Dale; POWER: 0.1W, 1/10W; PRICE_PER: 0.07000; STOCK: 18092; TOLERANCE: ±1%
R4 = r_0603:CRCW0603200KFKEB: 200000 ±1% 200k Thick Film 0.1W, 1/10W 0603; DIGIKEY: 541-4317-1-ND; HEIGHT: 1; MANUFACTURER: Vishay Dale; POWER: 0.1W, 1/10W; PRICE_PER: 0.07000; STOCK: 6081; TOLERANCE: ±1%
R5 = r_0603:CRCW0603100KFKEB: 100000 ±1% 100k Thick Film 0.1W, 1/10W 0603; DIGIKEY: 541-2972-1-ND; HEIGHT: 1; MANUFACTURER: Vishay Dale; POWER: 0.1W, 1/10W; PRICE_PER: 0.07000; STOCK: 201; TOLERANCE: ±1%
R6 = r_0603:CRCW0603475KFKTA: 475000 ±1% 475k Thick Film 0.1W, 1/10W 0603; DIGIKEY: 541-CRCW0603475KFKTACT-ND; HEIGHT: 1; MANUFACTURER: Vishay Dale; POWER: 0.1W, 1/10W; PRICE_PER: 0.12000; STOCK: 4543; TOLERANCE: ±1%
R7 R23 R25 = r_0603:CRCW06031K50FKEB: 1500 ±1% 1.5k Thick Film 0.1W, 1/10W 0603; DIGIKEY: 541-CRCW06031K50FKEBCT-ND; HEIGHT: 1; MANUFACTURER: Vishay Dale; POWER: 0.1W, 1/10W; PRICE_PER: 0.07000; STOCK: 2149; TOLERANCE: ±1%
R9 R24 R26 = r_0603:CRCW0603680RFKEB: 680 ±1% 680 Ohms Thick Film 0.1W, 1/10W 0603; DIGIKEY: 541-CRCW0603680RFKEBCT-ND; HEIGHT: 1; MANUFACTURER: Vishay Dale; POWER: 0.1W, 1/10W; PRICE_PER: 0.07000; STOCK: 46; TOLERANCE: ±1%
R10 = r_0603:CRCW0603150KFKEB: 150000 ±1% 150k Thick Film 0.1W, 1/10W 0603; DIGIKEY: 541-CRCW0603150KFKEBCT-ND; HEIGHT: 1; MANUFACTURER: Vishay Dale; POWER: 0.1W, 1/10W; PRICE_PER: 0.07000; STOCK: 6543; TOLERANCE: ±1%
R11 = r_0603:CRCW060395K3FKEA: 95300 ±1% 95.3k Thick Film 0.1W, 1/10W 0603; DIGIKEY: 541-95.3KHCT-ND; HEIGHT: 1; MANUFACTURER: Vishay Dale; POWER: 0.1W, 1/10W; PRICE_PER: 0.07000; STOCK: 8027; TOLERANCE: ±1%
R12 = r_0603:CRCW060313K3FKEB: 13300 ±1% 13.3k Thick Film 0.1W, 1/10W 0603; DIGIKEY: 541-CRCW060313K3FKEBCT-ND; HEIGHT: 1; MANUFACTURER: Vishay Dale; POWER: 0.1W, 1/10W; PRICE_PER: 0.07000; STOCK: 19503; TOLERANCE: ±1%
R13 = r_0603:CRCW060347K5FKEA: 47500 ±1% 47.5k Thick Film 0.1W, 1/10W 0603; DIGIKEY: 541-47.5KHCT-ND; HEIGHT: 1; MANUFACTURER: Vishay Dale; POWER: 0.1W, 1/10W; PRICE_PER: 0.07000; STOCK: 18001; TOLERANCE: ±1%
R15 = r_0603:CRCW060321K0FKEA: 21000 ±1% 21k Thick Film 0.1W, 1/10W 0603; DIGIKEY: 541-21.0KHCT-ND; HEIGHT: 1; MANUFACTURER: Vishay Dale; POWER: 0.1W, 1/10W; PRICE_PER: 0.07000; STOCK: 1226; TOLERANCE: ±1%
R18 = r_0603:CRCW06031K91FKEA: 1910 ±1% 1.91k Thick Film 0.1W, 1/10W 0603; DIGIKEY: 541-1.91KHCT-ND; HEIGHT: 1; MANUFACTURER: Vishay Dale; POWER: 0.1W, 1/10W; PRICE_PER: 0.07000; STOCK: 11460; TOLERANCE: ±1%
R22 = r_0603:CRCW060310R0FKTA: 10 ±1% 10 Ohms Thick Film 0.1W, 1/10W 0603; DIGIKEY: 541-2983-1-ND; HEIGHT: 1; MANUFACTURER: Vishay Dale; POWER: 0.1W, 1/10W; PRICE_PER: 0.12000; STOCK: 19024; TOLERANCE: ±1%
U1 = ICs:TLV3201: Analogue Comparator, Rail to Rail, Micropower, 1, 40 ns, 2.7V to 5.5V, SOT-23, 5 Pins; DIGIKEY: 296-36750-1-ND; HEIGHT: 2; PRICE_PER: 1.22
U3 U7 = ICs:PAM2312: Buck Switching Regulator IC Positive Adjustable 0.6V 1 Output 1A SOT-23-5 Thin, TSOT-23-5; DIGIKEY: PAM2312AABADJDICT-ND; HEIGHT: 1; PRICE_PER: 0.5
U5 = ICs:LM2731XMF: LM2731XMF/NOPB BOOST CONVERTER, 5-SOT-23; DIGIKEY: 296-35165-1-ND; HEIGHT: 1.45; PRICE_PER: 1.65
U6 = ICs:TPS54233: 2-A, 28-V INPUT, STEP-DOWN DC/DC CONVERTER WITH ECO-MODE SO8; DIGIKEY: 296-26985-5-ND; HEIGHT: 2; PRICE_PER: 1.64

## Net classes
1 USB: width 0.25 mm, drill 0.25 mm, clearance 1 mm

## Board
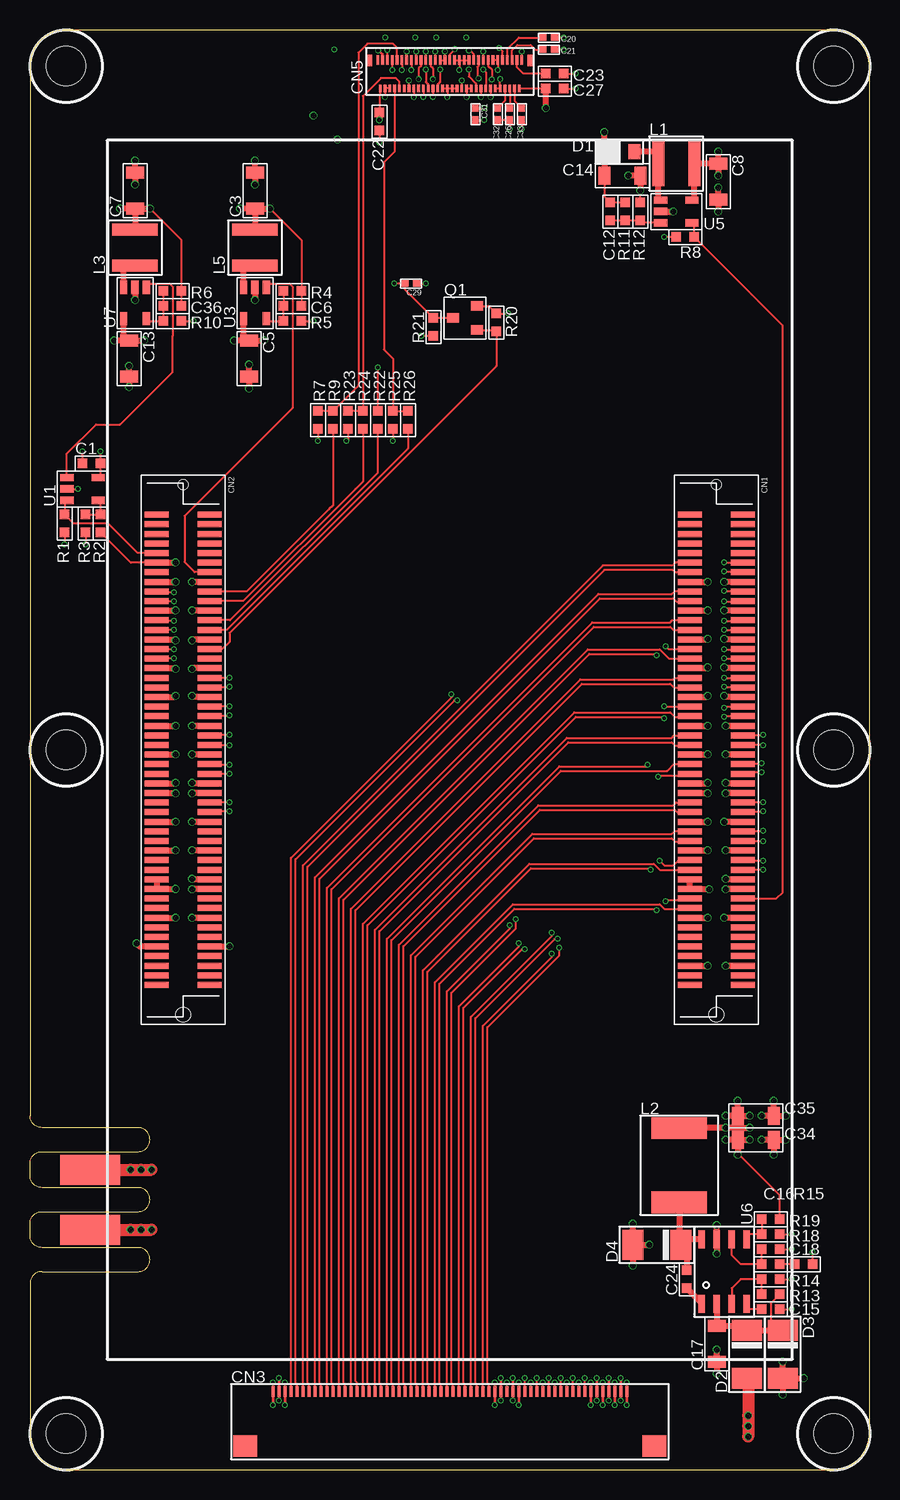
[diagram p5: board, top side]
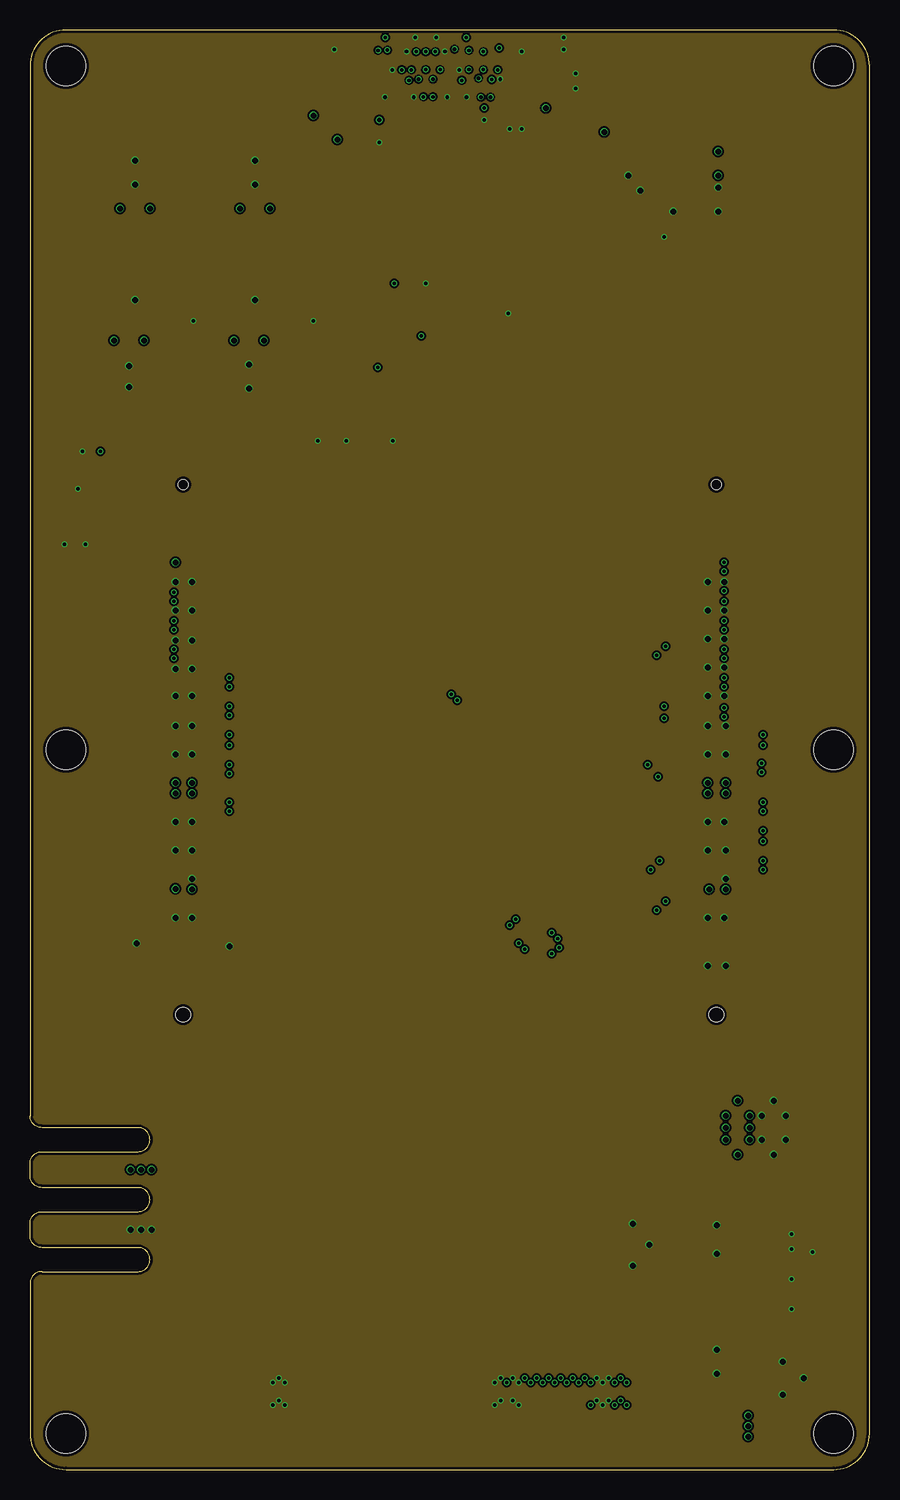
[diagram p6: board, inner layer GND]
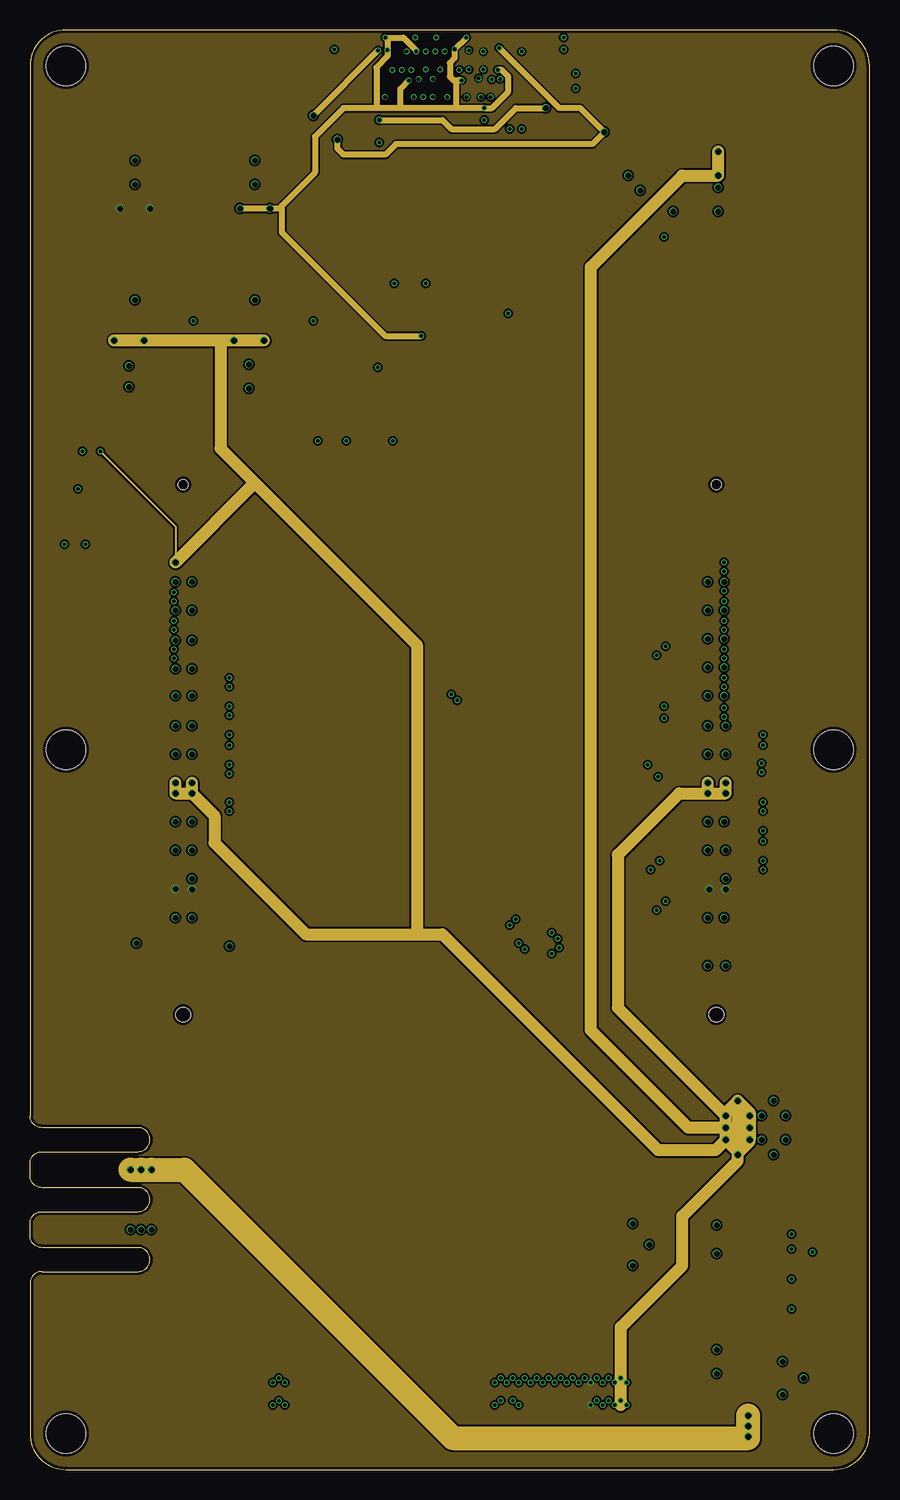
[diagram p7: board, inner layer PWR]
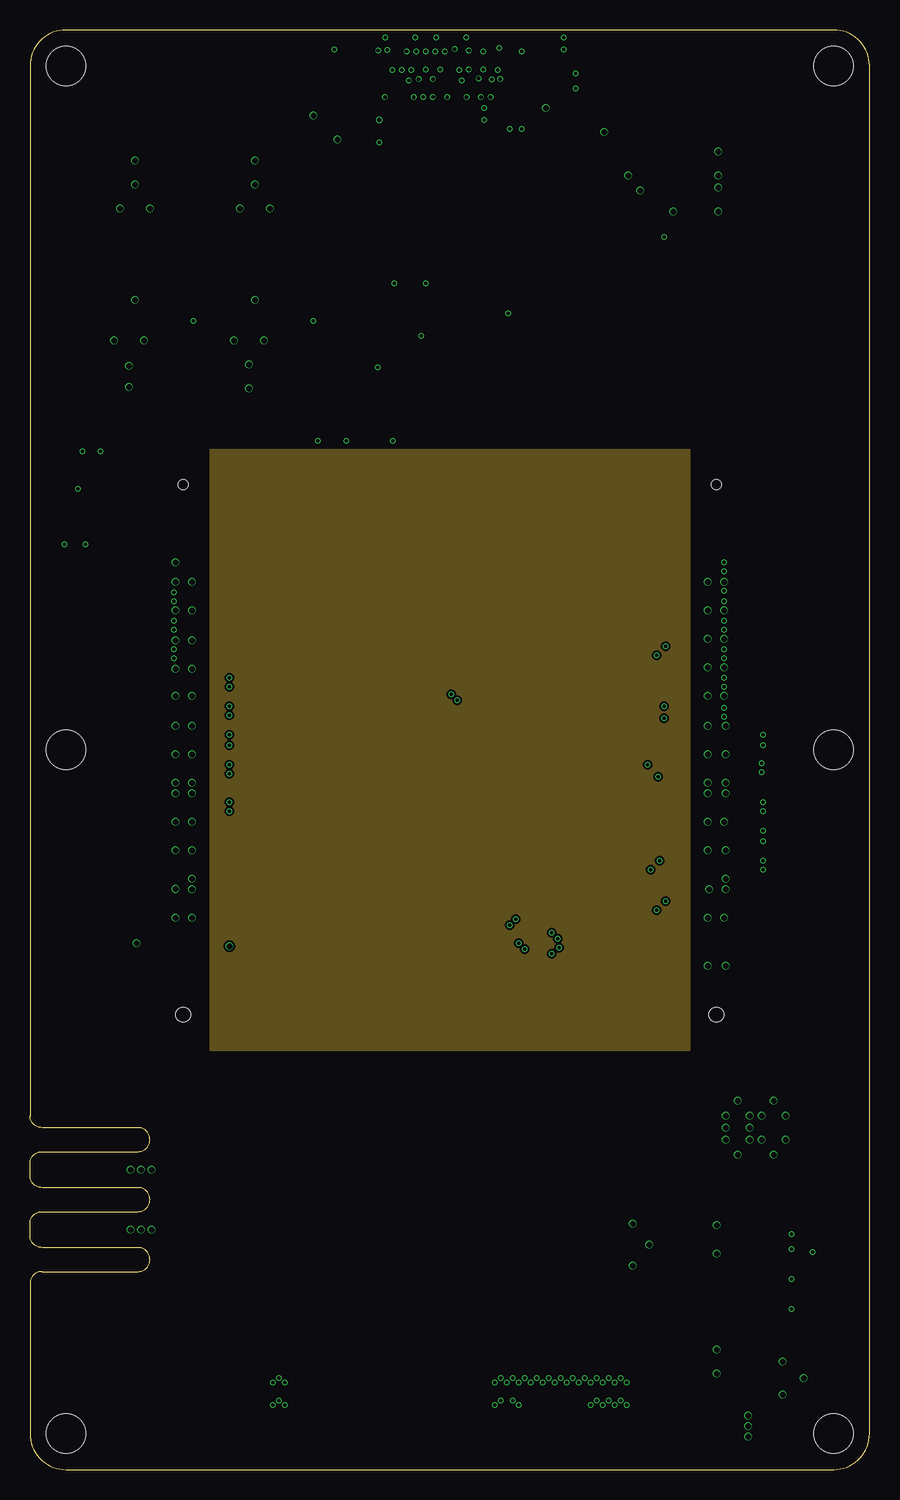
[diagram p8: board, inner layer PWR2]
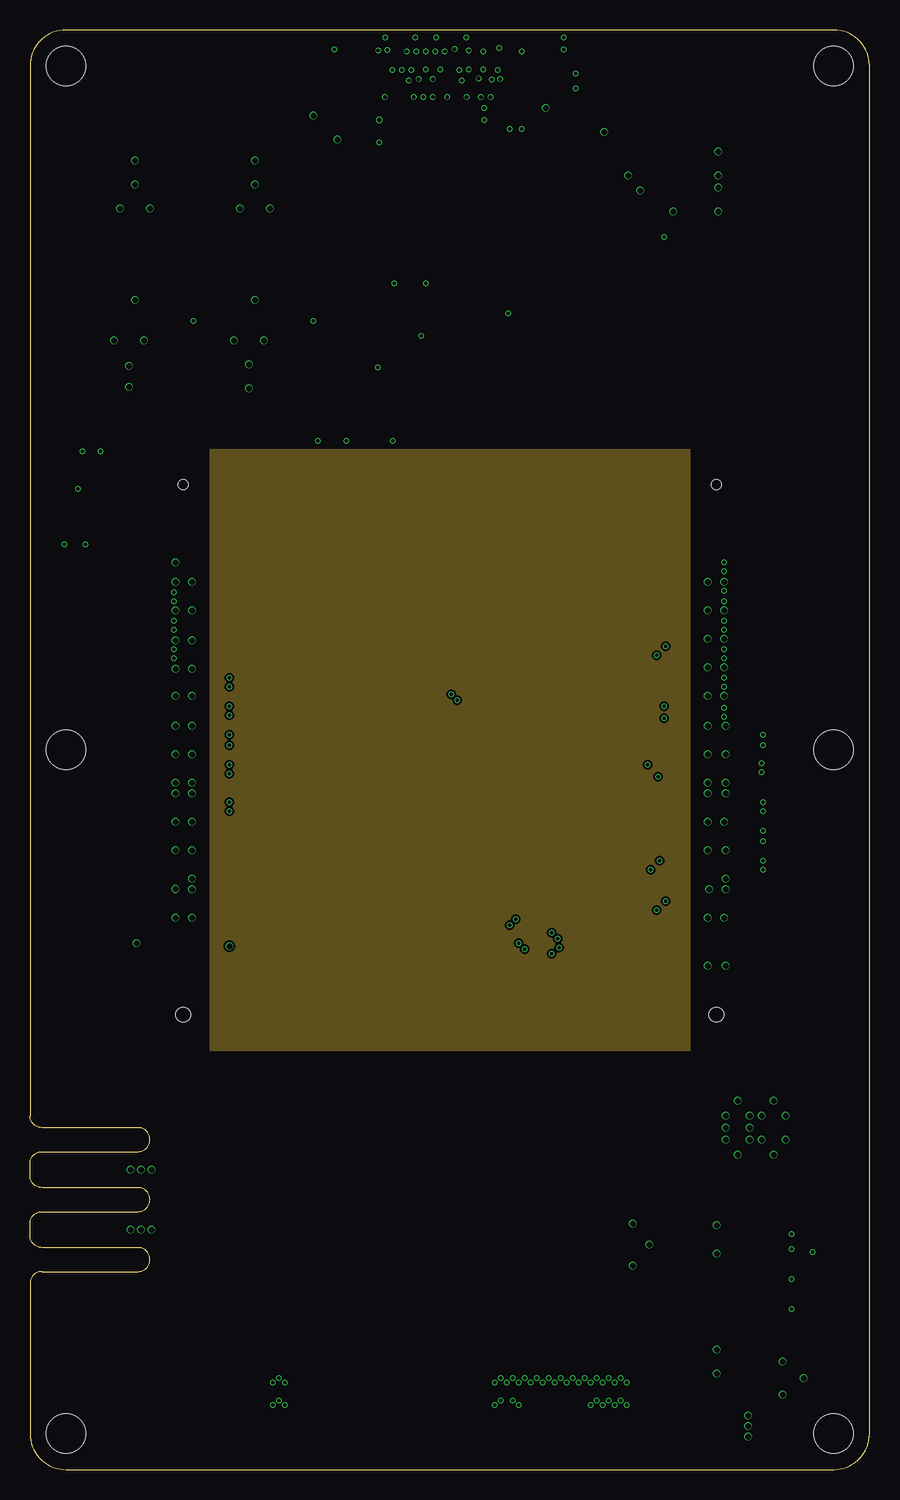
[diagram p9: board, inner layer SIGNAL]
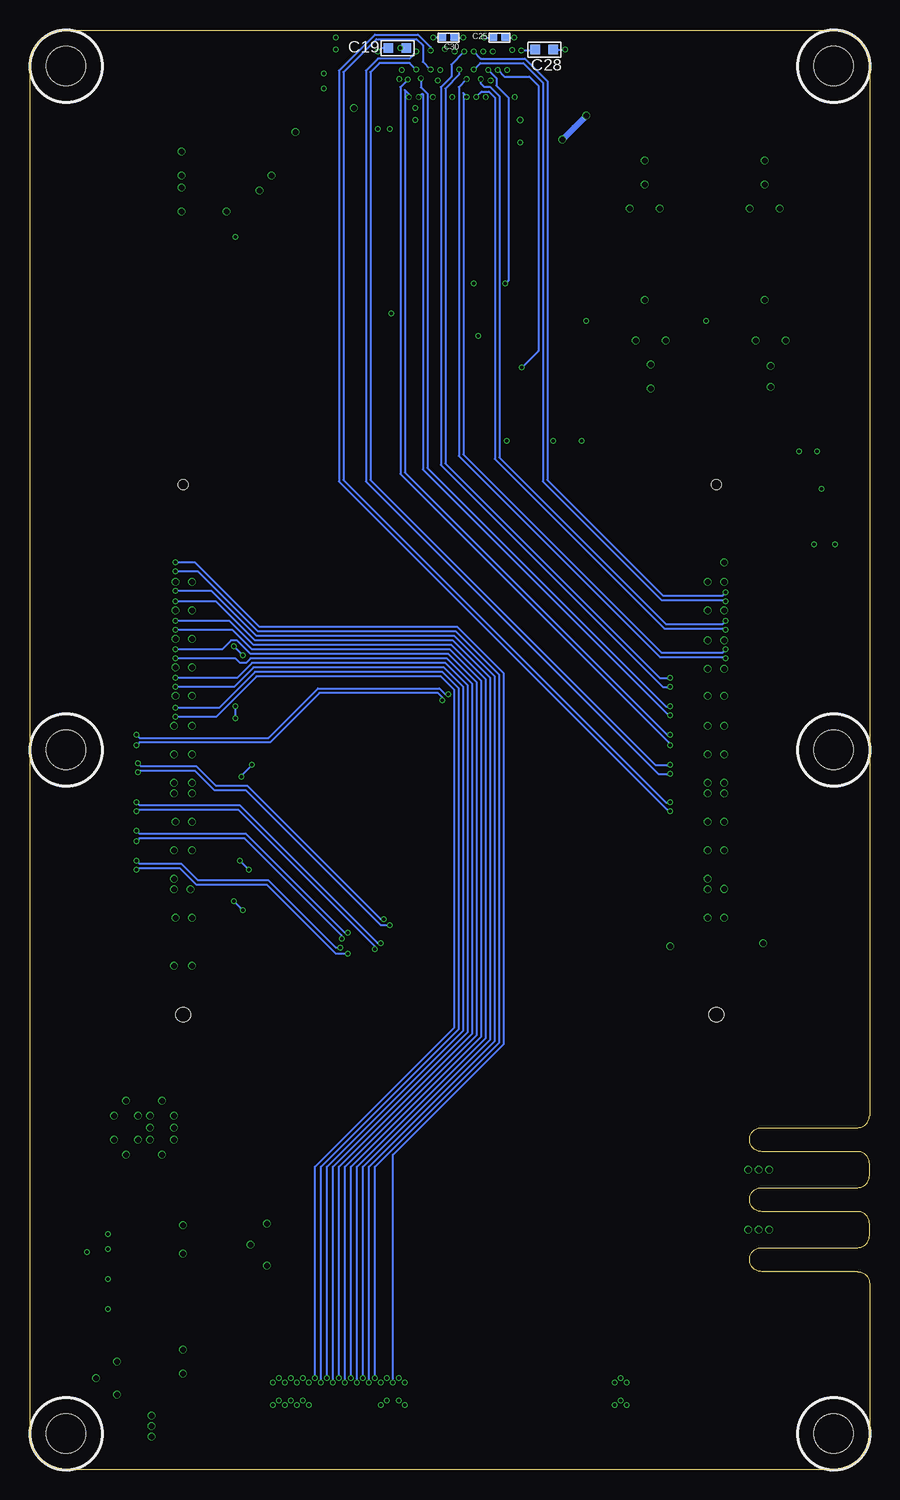
[diagram p10: board, bottom side, seen from below]

Size 70 x 120 mm. Coordinates in mm from the lower left corner, seen from the top.
Outline: 1,28.5 arc-90 0,29.5 0,117 arc-90 3,120 67,120 arc-90 70,117 70,3 arc-90 67,0 3,0 arc-90 0,3 0,15.5 arc-90 1,16.5
Copper layers (1*2*3*16): Top 0.035mm / dielectric 0.69mm / GND 0.035mm / dielectric 0.15mm / PWR 0.035mm / dielectric 0.2mm / Bottom 0.035mm
Design rules "valkyrie 4 layers 0.15mm": minimum track width 0.15mm, minimum drill 0.25mm, track to track 0.15mm, track to pad 0.15mm, pad to pad 0.15mm, via to via 0.15mm, smd to smd 0mil, copper to edge 0.25mm, drill to drill 0.25mm, minimum pad ring 3mil, minimum via ring 3mil, stop-mask expansion 4mil, vias tented up to drill 1mm, thermal gap 10mil

### Footprints (pad centres in the part's own frame; a part is rotated, then mirrored left to right if it is on the bottom)
0603 = smd 0.8 x 0.8: 1 -0.75,0; 2 0.75,0
1206 = smd 1 x 1.5: 1 1.5,0; 2 -1.5,0
0402 = smd 0.6 x 0.55: 1 -0.5,0; 2 0.5,0
61083-103400LF = smd 0.5 x 2: 1 -19.6,2.2; 2 -19.6,-2.2; 3 -18.8,2.2; 4 -18.8,-2.2; 5 -18,2.2; 6 -18,-2.2; 7 -17.2,2.2; 8 -17.2,-2.2; 9 -16.4,2.2; 10 -16.4,-2.2; 11 -15.6,2.2; 12 -15.6,-2.2; 13 -14.8,2.2; 14 -14.8,-2.2; 15 -14,2.2; 16 -14,-2.2; 17 -13.2,2.2; 18 -13.2,-2.2; 19 -12.4,2.2; 20 -12.4,-2.2; 21 -11.6,2.2; 22 -11.6,-2.2; 23 -10.8,2.2; 24 -10.8,-2.2; 25 -10,2.2; 26 -10,-2.2; 27 -9.2,2.2; 28 -9.2,-2.2; 29 -8.4,2.2; 30 -8.4,-2.2; 31 -7.6,2.2; 32 -7.6,-2.2; 33 -6.8,2.2; 34 -6.8,-2.2; 35 -6,2.2; 36 -6,-2.2; 37 -5.2,2.2; 38 -5.2,-2.2; 39 -4.4,2.2; 40 -4.4,-2.2; 41 -3.6,2.2; 42 -3.6,-2.2; 43 -2.8,2.2; 44 -2.8,-2.2; 45 -2,2.2; 46 -2,-2.2; 47 -1.2,2.2; 48 -1.2,-2.2; 49 -0.4,2.2; 50 -0.4,-2.2; 51 0.4,2.2; 52 0.4,-2.2; 53 1.2,2.2; 54 1.2,-2.2; 55 2,2.2; 56 2,-2.2; 57 2.8,2.2; 58 2.8,-2.2; 59 3.6,2.2; 60 3.6,-2.2; 61 4.4,2.2; 62 4.4,-2.2; 63 5.2,2.2; 64 5.2,-2.2; 65 6,2.2; 66 6,-2.2; 67 6.8,2.2; 68 6.8,-2.2; 69 7.6,2.2; 70 7.6,-2.2; 71 8.4,2.2; 72 8.4,-2.2; 73 9.2,2.2; 74 9.2,-2.2; 75 10,2.2; 76 10,-2.2; 77 10.8,2.2; 78 10.8,-2.2; 79 11.6,2.2; 80 11.6,-2.2; 81 12.4,2.2; 82 12.4,-2.2; 83 13.2,2.2; 84 13.2,-2.2; 85 14,2.2; 86 14,-2.2; 87 14.8,2.2; 88 14.8,-2.2; 89 15.6,2.2; 90 15.6,-2.2; 91 16.4,2.2; 92 16.4,-2.2; 93 17.2,2.2; 94 17.2,-2.2; 95 18,2.2; 96 18,-2.2; 97 18.8,2.2; 98 18.8,-2.2; 99 19.6,2.2; 100 19.6,-2.2 | hole 0.8: -22.1,0 | hole 1.2: 22.1,0
FH52E-60S-0.5SH = smd 0.25 x 0.85: P1 -14.75,2.5; P2 -14.25,2.5; P3 -13.75,2.5; P4 -13.25,2.5; P5 -12.75,2.5; P6 -12.25,2.5; P7 -11.75,2.5; P8 -11.25,2.5; P9 -10.75,2.5; P10 -10.25,2.5; P11 -9.75,2.5; P12 -9.25,2.5; P13 -8.75,2.5; P14 -8.25,2.5; P15 -7.75,2.5; P16 -7.25,2.5; P17 -6.75,2.5; P18 -6.25,2.5; P19 -5.75,2.5; P20 -5.25,2.5; P21 -4.75,2.5; P22 -4.25,2.5; P23 -3.75,2.5; P24 -3.25,2.5; P25 -2.75,2.5; P26 -2.25,2.5; P27 -1.75,2.5; P28 -1.25,2.5; P29 -0.75,2.5; P30 -0.25,2.5; P31 0.25,2.5; P32 0.75,2.5; P33 1.25,2.5; P34 1.75,2.5; P35 2.25,2.5; P36 2.75,2.5; P37 3.25,2.5; P38 3.75,2.5; P39 4.25,2.5; P40 4.75,2.5; P41 5.25,2.5; P42 5.75,2.5; P43 6.25,2.5; P44 6.75,2.5; P45 7.25,2.5; P46 7.75,2.5; P47 8.25,2.5; P48 8.75,2.5; P49 9.25,2.5; P50 9.75,2.5; P51 10.25,2.5; P52 10.75,2.5; P53 11.25,2.5; P54 11.75,2.5; P55 12.25,2.5; P56 12.75,2.5; P57 13.25,2.5; P58 13.75,2.5; P59 14.25,2.5; P60 14.75,2.5 | smd 2 x 1.8: SH1 -17.05,-2.025; SH3 17.05,-2.025
PCB_TAB_SMALL = smd 2.5 x 5: 1 0,0
046866761000846+ = smd 0.23 x 0.8: 1 6,0; 3 5.6,0; 5 5.2,0; 7 4.8,0; 9 4.4,0; 11 4,0; 13 3.6,0; 15 3.2,0; 17 2.8,0; 19 2.4,0; 21 2,0; 23 1.6,0; 25 1.2,0; 27 0.8,0; 29 0.4,0; 31 0,0; 33 -0.4,0; 35 -0.8,0; 37 -1.2,0; 39 -1.6,0; 41 -2,0; 43 -2.4,0; 45 -2.8,0; 47 -3.2,0; 49 -3.6,0; 51 -4,0; 53 -4.4,0; 55 -4.8,0; 57 -5.2,0; 59 -5.6,0; 61 -6,0 | smd 0.23 x 0.6: 2 5.8,2.37; 4 5.4,2.37; 6 5,2.37; 8 4.6,2.37; 10 4.2,2.37; 12 3.8,2.37; 14 3.4,2.37; 16 3,2.37; 18 2.6,2.37; 20 2.2,2.37; 22 1.8,2.37; 24 1.4,2.37; 26 1,2.37; 28 0.6,2.37; 30 0.2,2.37; 32 -0.2,2.37; 34 -0.6,2.37; 36 -1,2.37; 38 -1.4,2.37; 40 -1.8,2.37; 42 -2.2,2.37; 44 -2.6,2.37; 46 -3,2.37; 48 -3.4,2.37; 50 -3.8,2.37; 52 -4.2,2.37; 54 -4.6,2.37; 56 -5,2.37; 58 -5.4,2.37; 60 -5.8,2.37 | smd 0.4 x 0.95: P$1 6.685,0.045; P$2 -6.685,0.045
SOD-323 = smd 1 x 1.25: A -1.25,0; K 1.25,0
DO214AC = smd 1.75 x 2.5: A -2,0; K 2,0
IFSC-1515AH-01 = smd 1 x 3.8: 1 -1.5,0; 2 1.5,0
ECS-MPIL0630 = smd 1.8 x 4.6: 1 -3.1,0; 2 3.1,0
MOUNTHOLE_6X3 = hole 3.3: 0,0
SOT23-3 = smd 0.8 x 1: 1 -1,-1; 2 0,1; 3 1,-1
SOT23-5 = smd 0.6 x 1.1: 1 0.95,1.3; 2 0,1.3; 3 -0.95,1.3; 4 -0.95,-1.3; 5 0.95,-1.3
SO8 = smd 1.5 x 0.55: 1 -2.7,1.875; 2 -2.7,0.625; 3 -2.7,-0.625; 4 -2.7,-1.875; 5 2.7,-1.875; 6 2.7,-0.625; 7 2.7,0.625; 8 2.7,1.875

### Placement (x,y rotation side)
C1  5.12,83.88 180 top
C3  18.75,106.62 90 top
C5  18.25,92.62 270 top
C6  21.88,97 0 top
C7  8.75,106.62 90 top
C8  57.38,107.38 270 top
C12  48.38,104.88 90 top
C13  8.25,92.62 270 top
C14  49.38,107.88 0 top
C15  61.75,13.38 180 top
C16  61.75,17.12 180 top
C17  57.25,10.5 270 top
C18  61.75,18.38 180 top
C19  39.38,118.5 0 bottom
C20  43.25,119.38 180 top
C21  43.25,118.38 180 top
C22  29.12,112.38 270 top
C23  43.75,116.38 180 top
C24  54.75,15.88 270 top
C25  30.88,119.38 0 bottom
C26  40,113 270 top
C27  43.75,115.12 0 top
C28  27.12,118.38 180 bottom
C29  31.75,98.88 180 top
C30  35.12,119.38 180 bottom
C31  37.12,113 270 top
C32  39,113 270 top
C33  41,113 270 top
C34  60.5,27.5 0 top
C35  60.5,29.5 0 top
C36  11.88,97 0 top
CN1  57.23,60 270 top
CN2  12.77,60 270 top
CN3  35,4 0 top
CN4  5,25 90 top
CN5  35,117.5 180 top
CN6  5,20 90 top
D1  49.12,109.88 180 top
D2  59.75,9.62 90 top
D3  62.75,9.62 90 top
D4  52.25,18.75 0 top
L1  53.88,108.88 180 top
L2  54.12,25.38 90 top
L3  8.75,101.88 90 top
L5  18.75,101.88 90 top
MECH1  3,3 0 top
MECH2  3,117 0 top
MECH3  67,3 0 top
MECH4  67,117 0 top
MECH5  3,60 0 top
MECH6  67,60 0 top
Q1  36.25,96 90 top
R1  2.88,78.88 90 top
R2  5.88,78.88 270 top
R3  4.62,78.88 90 top
R4  21.88,98.25 0 top
R5  21.88,95.75 180 top
R6  11.88,98.25 0 top
R7  24,87.5 90 top
R8  54.62,102.75 0 top
R9  25.25,87.5 90 top
R10  11.88,95.75 180 top
R11  49.62,104.88 90 top
R12  50.88,104.88 270 top
R13  61.75,14.62 0 top
R14  61.75,15.88 180 top
R15  64.5,17.12 180 top
R18  61.75,19.62 180 top
R19  61.75,20.88 0 top
R20  38.88,95.62 90 top
R21  33.62,95.25 270 top
R22  29,87.5 90 top
R23  26.5,87.5 90 top
R24  27.75,87.5 90 top
R25  30.25,87.5 90 top
R26  31.5,87.5 90 top
U1  4.38,81.75 90 top
U3  18.75,97.25 0 top
U5  53.88,104.88 90 top
U6  57.88,16.5 90 top
U7  8.75,97.25 0 top

### Tracks (layer width: path | path; a pad name or v marks a point on that pad's centre or on a via)
EVF_LVDS_CLK0_N  (via drill 0.3)
  Top 0.15: CN5.20 v32.8,114.42 | v12,70 CN2.26
  Bottom 0.15: v32.8,114.42 32.35,114.88 31.75,114.88 31.25,114.38 31.25,84.25 17.12,70.12 12.12,70.12 v12,70
EVF_LVDS_CLK0_P  (via drill 0.3)
  Top 0.15: v32.4,115.9 32.4,116.8 32.6,117 CN5.19 | v12,70.75 10.62,70.75 CN2.24
  Bottom 0.15: v32.4,115.9 32.4,115.53 32.12,115.25 31.62,115.25 30.88,114.5 30.88,84.38 17,70.5 12.25,70.5 v12,70.75
EVF_LVDS_CLK1_N  (via drill 0.3)
  Top 0.15: CN5.48 v38.4,114.4 | v16.62,61.25 15.02,61.25 CN2.47
  Bottom 0.15: v38.4,114.4 38.4,114.65 38.75,115 38.75,83.12 16.88,61.25 v16.62,61.25
EVF_LVDS_CLK1_P  (via drill 0.3)
  Top 0.15: CN5.47 38.2,117 38.5,116.7 v38.5,115.88 | v16.62,60.38 15,60.38 CN2.49
  Bottom 0.15: v38.5,115.88 39.12,115.25 39.12,83 16.62,60.5 v16.62,60.38
EVF_LVDS_D0_N  (via drill 0.3)
  Top 0.15: CN5.22 33.2,115.48 33,115.68 v33,116.7 | v12,72.38 10.6,72.38 CN2.20
  Bottom 0.15: v33,116.7 32.45,117.25 28.88,117.25 27.25,115.62 27.25,82.38 17.38,72.5 12.12,72.5 v12,72.38
EVF_LVDS_D0_P  (via drill 0.3)
  Top 0.15: CN5.21 v33,118.2 | v12,73.12 10.65,73.12 CN2.18
  Bottom 0.15: v33,118.2 32.42,117.62 28.75,117.62 26.88,115.75 26.88,82.5 17.25,72.88 12.25,72.88 v12,73.12
EVF_LVDS_D1_N  (via drill 0.3)
  Top 0.15: CN5.24 v33.6,114.42 | v12,68.38 10.6,68.38 CN2.30
  Bottom 0.15: v33.6,114.42 33.6,114.47 33.88,114.75 33.88,84.62 17.38,68.12 12.25,68.12 v12,68.38
EVF_LVDS_D1_P  (via drill 0.3)
  Top 0.15: CN5.23 33.4,117 33.6,116.8 v33.6,115.9 | v12,67.62 10.6,67.62 CN2.32
  Bottom 0.15: v33.6,115.9 34.25,115.25 34.25,84.5 17.5,67.75 12.12,67.75 v12,67.62
EVF_LVDS_D2_N  (via drill 0.3)
  Top 0.15: CN5.26 34,115.5 34.2,115.7 v34.2,116.7 | v16.62,66 CN2.35
  Bottom 0.15: v34.2,116.7 34.2,116.3 35.38,115.12 35.38,83.88 17.5,66 v16.62,66
EVF_LVDS_D2_P  (via drill 0.3)
  Top 0.15: CN5.25 v33.8,118.2 | v16.62,65.25 16.57,65.2 CN2.37
  Bottom 0.15: v33.8,118.2 34.88,117.12 34.88,116.12 35.75,115.25 35.75,83.75 17.25,65.25 v16.62,65.25
EVF_LVDS_D7_N  (via drill 0.3)
  Top 0.15: CN5.42 37.2,115.53 36.6,116.13 v36.6,116.7 | v16.62,55.62 16.6,55.6 CN2.61
  Bottom 0.15: v36.6,116.7 37.25,117.35 37.25,118.72 37.77,119.25 41.12,119.25 43.88,116.5 43.88,82.5 17,55.62 v16.62,55.62
EVF_LVDS_D7_P  (via drill 0.3)
  Top 0.15: v36.6,118.3 36.7,118.3 37,118 CN5.41 | v16.62,54.88 14.62,54.88 14.7,54.8 CN2.63
  Bottom 0.15: v36.6,118.3 36.6,118.58 37.65,119.62 41.25,119.62 44.25,116.62 44.25,82.38 16.75,54.88 v16.62,54.88
EVF_LVDS_D8_N  (via drill 0.3)
  Top 0.15: CN5.44 v37.6,114.4 | v16.62,62.88 16.55,62.8 CN2.43
  Bottom 0.15: v37.6,114.4 37.35,114.65 37.25,114.65 37.25,83.38 16.75,62.88 v16.62,62.88
EVF_LVDS_D8_P  (via drill 0.3)
  Top 0.15: v37.4,115.97 37.3,116.08 37.3,116.9 37.4,117 CN5.43 | v16.62,63.62 16.6,63.6 CN2.41
  Bottom 0.15: v37.4,115.97 37.4,115.22 36.88,114.7 36.88,83.5 17,63.62 v16.62,63.62
EVF_LVDS_D9_N  (via drill 0.3)
  Top 0.15: v37.8,116.7 38,116.5 CN5.46 | v16.62,58.75 15.02,58.75 CN2.53
  Bottom 0.15: v37.8,116.7 38.35,117.25 40.88,117.25 41.62,116.5 41.62,82.5 17.88,58.75 v16.62,58.75
EVF_LVDS_D9_P  (via drill 0.3)
  Top 0.15: CN5.45 v37.8,118.2 | v16.62,58 CN2.55
  Bottom 0.15: v37.8,118.2 38.38,117.62 41,117.62 42,116.62 42,82.38 17.62,58 v16.62,58
EVF_PWR_1V8  (via drill 0.3, 0.5)
  Top 0.15: CN5.17 v32.2,118.2 | CN5.5 v29.8,118.33 | CN5.14 v31.6,115.8 | v35.4,118.4 35.4,118.38 35,117.97 CN5.31 | CN5.36 v36,115.8 | CN5.49 CN5.51 v39,116.67 | C31.1 v37.88,113.5 | R21.2 v32.62,94.5 | v20,105.12 22.62,102.5 R4.2 C6.2
  Top 0.5: C3.2 L5.2 | C3.2 v17.5,105.12 | C3.2 v20,105.12
  PWR 0.5: v32.2,118.2 32.2,118.3 31.12,119.38 v29.62,119.38 29.8,119.2 v29.8,118.33 29.8,117.8 28.88,116.88 28.88,113.5 | v36.38,119.38 v35.4,118.4 35.4,117.65 35,117.25 35,116.12 35.33,115.8 v36,115.8 35.62,115.8 35.5,115.67 35.5,113.5 | 35.5,113.5 v37.88,113.5 38.5,113.5 39.88,114.88 39.88,116.12 39.33,116.67 v39,116.67 | v31.6,115.8 30.88,115.08 30.88,113.5 | 35.5,113.5 30.88,113.5 | 30.88,113.5 28.88,113.5 | v32.62,94.5 29.62,94.5 21,103.12 21,105.12 | 21,105.12 21,105.38 23.75,108.12 23.75,111.12 26.12,113.5 28.88,113.5 | 21,105.12 v17.5,105.12
  Bottom 0.15: C30.2 v36.38,119.38 | C25.2 v29.62,119.38
EVF_PWR_1V8_EN
  Top 0.15: CN2.13 13.73,74.8 12.88,75.65 12.88,79.5 21.88,88.5 21.88,98.62 21.62,98.88 20.02,98.88 U3.1
EVF_PWR_10V  (via drill 0.3, 0.5)
  Top 0.15: v29.02,118.3 29.1,118.3 29.4,118 CN5.3 | CN5.53 39.4,118.22 v39.12,118.5 | C14.2 47.88,106.12 C12.2 R11.2
  Top 0.5: C14.2 D1.K v47.88,111.5
  PWR 0.5: v39.12,118.5 44.12,113.5 45.88,113.5 v47.88,111.5 46.88,110.5 30.5,110.5 29.62,109.62 26.12,109.62 25.62,110.12 v25.62,110.88 | v23.62,112.88 23.62,112.9 v29.02,118.3
  Bottom 0.15: v29.02,118.3 27.95,118.3 C28.2 | v39.12,118.5 C19.2
  Bottom 0.5: v25.62,110.88 24.62,111.88 v23.62,112.88
EVF_PWR_10V_EN
  Top 0.15: U5.4 55.38,103.72 R8.2 62.75,95.38 62.75,48.12 62.23,47.6 CN1.81
EVF_SPI_!CS
  Top 0.15: CN5.8 30.4,109.88 29.5,108.97 29.5,93.38 30.25,92.62 R25.2 R26.2
EVF_SPI_MISO  (via drill 0.3)
  Top 0.15: CN5.11 v31,116.67 | R22.2 v29,91.88
  Bottom 0.15: v31,116.67 30.45,116.12 28.38,116.12 27.62,115.38 27.62,93.25 v29,91.88
EVF_SPI_MOSI
  Top 0.15: CN5.10 30.8,115.7 30.5,116 29.25,116 27.75,114.5 R24.2 R23.2
EVF_SPI_SCLK
  Top 0.15: CN5.9 30.6,118.53 30.25,118.88 28.12,118.88 27.38,118.12 27.38,90.38 R9.2 R7.2
EVF_SYS_!RESET  (via drill 0.3)
  Top 0.15: CN5.15 v31.8,116.67 | v30.38,98.88 C29.2 31.25,98.38 R21.1 Q1.2
  Bottom 0.15: v31.8,116.67 31.12,116 31.12,115.38 30.12,114.38 30.12,99.12 v30.38,98.88
EVF_VCAL
  Top 0.15: CN5.55 39.8,118.42 40.75,119.38 C20.2
EVF_VCCP  (via drill 0.4, 0.5)
  Top 0.15: CN5.2 29.2,114.7 29.12,114.62 C22.1 | CN5.60 C27.1
  Top 0.5: C22.1 v29.12,112.5 | v43,113.5 C27.1
  PWR 0.5: v29.12,112.5 34.38,112.5 35.12,111.75 38.75,111.75 40.5,113.5 v43,113.5
EVF_VG0
  Top 0.15: CN5.57 40.2,118.33 40.62,118.75 41.75,118.75 42.12,118.38 C21.2
EVF_VG255
  Top 0.15: CN5.56 C26.1
EVF_VGC
  Top 0.15: CN5.54 39.6,114.1 C32.1
EVF_VOFS
  Top 0.15: CN5.58 40.4,114.1 C33.1
EVF_VREF
  Top 0.15: C23.2 41.12,116.38 40.6,116.9 CN5.59
FPGA_EVF_SPI_!CS
  Top 0.15: CN2.25 16.38,70 31.5,85.12 R26.1
FPGA_EVF_SPI_MISO
  Top 0.15: CN2.23 16.68,70.8 29,83.12 R22.1
FPGA_EVF_SPI_MOSI
  Top 0.15: CN2.19 17.77,72.4 27.12,81.75 27.75,82.38 R24.1
FPGA_EVF_SPI_SCLK
  Top 0.15: CN2.17 18.07,73.2 24.94,80.06 25.25,80.38 R9.1
FPGA_EVF_SYS_!RESET
  Top 0.15: Q1.1 38.75,95 R20.1 38.88,92 16.62,69.75 16.62,69 16.02,68.4 CN2.29
FPGA_VCCO_EN
  Top 0.15: U1.3 2.88,80.6 R1.2 3.62,78.88 6.5,78.88 8.98,76.4 CN2.10
GND  (via drill 0.3, 0.5)
  Top 0.15: CN5.7 v30.2,116.67 | v29.6,114.4 CN5.4 CN5.6 | CN5.13 v31.4,118.2 | CN5.16 v32,114.4 | CN5.27 CN5.29 v34.6,118.2 | CN5.33 CN5.35 | CN5.35 CN5.37 CN5.39 | CN5.35 v35.8,116.67 | CN5.28 CN5.30 | CN5.30 CN5.32 CN5.34 | CN5.30 v34.8,114.4 | CN5.40 CN5.38 v36.4,114.4 | CN5.61 v41,118.2 | CN5.50 CN5.52 v39.2,115.9 | C22.2 v29.12,110.62 | C31.2 v37.88,112.5 | C32.2 C26.2 v40,111.75 | C33.2 v41,111.75 | C27.2 v45.5,115.12 | C23.1 v45.5,116.38 | v44.5,118.38 C21.1 | C20.1 v44.5,119.38 | C29.1 v33,98.88 | v39.88,96.38 R20.2 38.25,97 Q1.3 | C15.1 v63.5,13.38 | R14.1 v63.5,15.88 | C18.1 v63.5,18.38 | R15.1 v65.25,18.12 | R18.1 v63.5,19.62 | R12.1 v50.88,106.62 | R8.1 v52.88,102.75 | C1.2 v4.38,84.88 | U1.2 v4,81.75 | R1.1 v2.88,77.12 | R3.1 v4.62,77.12 | R10.1 v13.62,95.75 | R5.1 v23.62,95.75 | R25.1 v30.25,85.75 | R23.1 26.5,85.88 v26.38,85.75 | R7.1 v24,85.75
  Top 0.2: v21.25,7.25 CN3.P3 v21.25,5.38 | v20.75,7.62 CN3.P2 v20.75,5.75 | v20.25,7.25 CN3.P1 v20.25,5.38 | v38.75,7.25 CN3.P38 v38.75,5.38 | v39.25,7.62 CN3.P39 v39.25,5.75 | v40.25,7.62 CN3.P41 v40.25,5.75 | v40.75,7.25 CN3.P42 v40.75,5.38 | v47.25,7.62 CN3.P55 v47.25,5.75 | v47.75,5.38 CN3.P56 v47.75,7.25 | v48.25,5.75 CN3.P57 v48.25,7.62
  Top 0.5: CN1.16 v56.5,74 | CN1.15 v57.88,74 | CN1.22 56.48,71.6 v56.5,71.62 | CN1.21 57.9,71.6 v57.88,71.62 | CN1.28 56.45,69.2 v56.5,69.25 | CN1.27 57.92,69.2 v57.88,69.25 | CN1.34 56.42,66.8 v56.5,66.88 | CN1.33 57.95,66.8 v57.88,66.88 | CN1.40 56.4,64.4 v56.5,64.5 | CN1.39 57.98,64.4 v57.88,64.5 | CN1.46 v56.5,62 | CN1.45 v58,62 | CN1.52 56.48,59.6 v56.5,59.62 | CN1.51 58.02,59.6 v58,59.62 | CN1.66 v56.5,54 | CN1.65 v57.88,54 | CN1.72 56.48,51.6 v56.5,51.62 | CN1.71 58.02,51.6 v58,51.62 | CN1.86 v56.5,46 | CN1.85 v57.88,46 | CN1.96 v56.5,42 | CN1.95 v58,42 | CN1.77 58.05,49.2 v58,49.25 | CN2.92 9.15,43.6 v8.88,43.88 | CN2.91 16.6,43.6 v16.62,43.62 | CN2.86 v12.12,46 | CN2.85 v13.5,46 | CN2.77 13.55,49.2 v13.5,49.25 | CN2.71 13.52,51.6 v13.5,51.62 | CN2.72 12.1,51.6 v12.12,51.62 | CN2.65 v13.5,54 | CN2.66 v12.12,54 | CN2.52 12.1,59.6 v12.12,59.62 | CN2.51 13.52,59.6 v13.5,59.62 | CN2.46 v12.12,62 | CN2.45 v13.5,62 | CN2.40 12.02,64.4 v12.12,64.5 | CN2.39 13.6,64.4 v13.5,64.5 | CN2.34 12.07,66.8 v12.12,66.75 | CN2.33 13.55,66.8 v13.5,66.75 | CN2.28 12.05,69.2 v12.12,69.12 | CN2.27 13.57,69.2 v13.5,69.12 | CN2.22 12.1,71.6 v12.12,71.62 | CN2.21 13.52,71.6 v13.5,71.62 | CN2.16 v12.12,74 | CN2.15 v13.5,74 | D4.A v51.62,18.75 | D4.A v50.25,17 | D4.A v50.25,20.5 | D3.A v62.75,9 | D3.A v64.5,7.62 | D3.A v62.75,6.25 | v57.25,8 C17.1 v57.25,10 | C34.1 v61,27.5 | C35.1 v61,29.5 | C35.1 v63,29.5 | C34.1 v63,27.5 | C34.1 v62,26.25 | C35.1 v62,30.75 | v57.25,18 U6.7 v57.25,20.38 | v57.38,106.88 C8.1 v57.38,104.88 | U5.2 v53.62,104.88 | v49.88,107.88 C14.1 v50.88,106.62 | U7.2 v8.75,97.5 | v8.25,92 C13.1 v8.25,90.25 | v8.75,107.12 C7.1 v8.75,109.12 | v18.75,107.12 C3.1 v18.75,109.12 | U3.2 v18.75,97.5
  Top 0.5: v18.25,92.12 C5.1 v18.25,90.12
  Top 1: CN6.1 v8.38,20 v9.25,20 v10.12,20
  Bottom 0.15: C28.1 v25.38,118.38 | v32.12,119.38 C25.1 | C30.1 v33.88,119.38 | C19.1 40.7,118.5 v41,118.2
  pour GND: 0,0 70,0 70,120 0,120
N$2
  Top 0.15: R3.2 R2.1 5.88,80.6 U1.4
N$4
  Top 0.5: L2.1 54.12,18.88 | 54.12,18.88 D4.K 54.75,18.25 C24.1 | U6.8 54.45,19.2 54.12,18.88
N$5
  Top 0.5: C24.2 56,13.88 U6.1
N$6
  Top 0.15: R13.2 61.75,13.88 61.75,11.75 61.88,11.62 62.5,11.62 D3.K
  Top 0.5: U6.2 C17.2 59.38,12 D2.K 62.5,11.62
N$7
  Top 0.15: R14.2 60.88,15.88 | 60.88,15.88 59.25,15.88 58.5,15.12 U6.3 | R13.1 61,15.75 60.88,15.88
N$8
  Top 0.15: U6.5 59.75,19.58 59.8,19.62 R18.2 R19.1
N$9
  Top 0.15: C18.2 C16.2 59.25,17.12 58.5,17.88 U6.6
N$10
  Top 0.15: R15.2 C16.1
N$11
  Top 0.15: C15.2 59.8,13.38 59.75,13.42 U6.4
N$12  (via drill 0.5)
  Top 1: D2.A 59.88,7.5 v59.88,4.5 v59.88,3.62 v59.88,2.75 | CN4.1 v8.38,25 v9.25,25 v10.12,25
  PWR 2: v8.38,25 v9.25,25 v10.12,25 12.88,25 35.25,2.62 59.88,2.62 v59.88,2.75 v59.88,3.62 v59.88,4.5
N$14
  Top 0.5: U7.3 7.8,100.33 7.75,100.38 L3.1
N$15
  Top 0.15: U7.5 9.9,95.75 R10.2 C36.1 R6.1
N$17
  Top 0.5: U3.3 17.8,100.33 17.75,100.38 L5.1
N$18
  Top 0.15: R4.1 C6.1 R5.2 19.9,95.75 U3.5
N$119
  Top 0.5: U5.1 52.38,106.03 L1.2 52.38,109.88 D1.A
N$121
  Top 0.15: U5.3 51.08,103.92 R12.2 R11.1 C12.1
SEN_B_D0_N
  Top 0.15: CN3.P28 33.75,40.62 40.25,47.12 52.5,47.12 52.88,46.75 54.98,46.75 CN1.84
SEN_B_D0_P  (via drill 0.3)
  Top 0.15: CN3.P29 34.25,7.12 34.12,7.25 34.12,40.5 40.38,46.75 52.12,46.75 v52.25,46.62 | v53,47.38 53.12,47.5 54.92,47.5 CN1.82
  Bottom 0.15: v52.25,46.62 v53,47.38
SEN_B_D3_N
  Top 0.15: CN3.P26 32.75,41.62 41.62,50.5 52,50.5 52.5,50 CN1.76
SEN_B_D3_P  (via drill 0.3)
  Top 0.15: CN3.P27 33.25,7.12 33.12,7.25 33.12,41.5 41.75,50.12 51.62,50.12 v51.75,50 | v52.5,50.75 52.88,50.38 53.62,50.38 54.12,50.88 54.95,50.88 CN1.74
  Bottom 0.15: v51.75,50 v52.5,50.75
SEN_B_D6_N  (via drill 0.3)
  Top 0.15: CN3.P33 36.25,7.12 36.12,7.25 36.12,38.5 41,43.38 v41.25,43.38 | v61.12,54.88 61.05,54.8 CN1.63
  Bottom 0.15: v41.25,43.38 41.25,43.62 52.62,55 61,55 v61.12,54.88
SEN_B_D6_P  (via drill 0.3)
  Top 0.15: CN3.P32 35.75,38.62 40.75,43.62 v40.75,43.88 | v61.12,55.62 61.1,55.6 CN1.61
  Bottom 0.15: v40.75,43.88 41,43.88 52.5,55.38 60.88,55.38 v61.12,55.62
SEN_B_D9_N
  Top 0.15: CN3.P25 32.25,7.12 32.12,7.25 32.12,42.75 42,52.62 53.5,52.62 53.75,52.38 55,52.38 CN1.70
SEN_B_D9_P
  Top 0.15: CN3.P24 31.75,42.88 41.88,53 53.5,53 53.75,53.25 54.98,53.25 CN1.68
SEN_B_D12_N  (via drill 0.3)
  Top 0.15: CN3.P20 29.75,44.25 44.12,58.62 51.38,58.62 v51.5,58.75 | v52.38,57.75 52.5,57.88 54.5,57.88 54.62,58 CN1.56
  Bottom 0.15: v51.5,58.75 52.38,57.88 v52.38,57.75
SEN_B_D12_P
  Top 0.15: CN3.P21 30.25,7.12 30.12,7.25 30.12,44.12 44.25,58.25 53.12,58.25 53.67,58.8 CN1.54
SEN_B_D15_N
  Top 0.15: CN3.P16 27.75,45.5 45.38,63.12 53.38,63.12 53.75,62.75 55.38,62.75 55.33,62.8 CN1.44
SEN_B_D15_P  (via drill 0.3)
  Top 0.15: CN3.P17 28.25,7.12 28.12,7.25 28.12,45.38 45.5,62.75 52.75,62.75 v52.88,62.62 | v52.88,63.62 55,63.62 CN1.42
  Bottom 0.15: v52.88,62.62 v52.88,63.62
SEN_B_D18_N
  Top 0.15: CN3.P15 27.25,7.25 27.12,7.38 27.12,46.62 46,65.5 53.38,65.5 53.67,65.2 CN1.38
SEN_B_D18_P
  Top 0.15: CN3.P14 26.75,46.75 45.88,65.88 53.62,65.88 53.75,66 CN1.36
SEN_B_D21_N
  Top 0.15: CN3.P11 25.25,7.12 25.12,7.25 25.12,48.38 47,70.25 53.38,70.25 53.62,70 CN1.26
SEN_B_D21_P
  Top 0.15: CN3.P10 24.75,48.5 46.88,70.62 53.38,70.62 53.55,70.8 CN1.24
SEN_CLK_IN  (via drill 0.3)
  Top 0.15: CN3.P46 v42.75,7.25 | v57.88,70.75 59.38,70.75 CN1.23
  Bottom 0.15: v42.75,7.25 42.75,25.25 32,36 32,65.88 34.88,68.75 51.38,68.75 53.38,70.75 v57.88,70.75
SEN_CLK_N  (via drill 0.3)
  Top 0.15: CN3.P5 22.25,7.12 22.12,7.25 22.12,50.88 35.38,64.12 v35.62,64.12 | v61.12,60.38 61.1,60.4 CN1.49
  Bottom 0.15: v35.62,64.12 35.62,64.38 36,64.75 45.88,64.75 50,60.62 60.88,60.62 v61.12,60.38
SEN_CLK_P  (via drill 0.3)
  Top 0.15: CN3.P4 21.75,51 35.12,64.38 v35.12,64.62 | v61.12,61.25 61.08,61.2 CN1.47
  Bottom 0.15: v35.12,64.62 35.38,64.62 35.88,65.12 46,65.12 50.12,61 60.88,61 v61.12,61.25
SEN_PWR_3V3A
  pour SIGNAL (rank 6): 15,35 55,35 55,85 15,85
SEN_PWR_EN  (via drill 0.3)
  Top 0.15: CN3.P40 v39.75,7.25 | v57.88,75.62 59.4,75.62 CN1.11
  Bottom 0.15: v39.75,7.25 39.75,26.25 30.5,35.5 30.5,66.38 34.38,70.25 50.88,70.25 56.25,75.62 v57.88,75.62
SEN_SPI_!CS  (via drill 0.3)
  Top 0.15: CN3.P45 v42.25,7.62 | v57.88,72.38 59.4,72.38 CN1.19
  Bottom 0.15: v42.25,7.62 42.25,25.25 31.62,35.88 31.62,66 34.75,69.12 51.25,69.12 54.5,72.38 v57.88,72.38
SEN_SPI_MISO  (via drill 0.3)
  Top 0.15: CN3.P44 v41.75,7.25 | v57.88,73.25 59.38,73.25 CN1.17
  Bottom 0.15: v41.75,7.25 41.75,25.25 31.25,35.75 31.25,66.12 34.62,69.5 51.12,69.5 54.88,73.25 v57.88,73.25
SEN_SPI_MOSI  (via drill 0.3)
  Top 0.15: CN3.P43 v41.25,7.62 | v57.88,74.88 59.75,74.88 59.67,74.8 CN1.13
  Bottom 0.15: v41.25,7.62 41.25,25.25 30.88,35.62 30.88,66.25 34.5,69.88 51,69.88 56,74.88 v57.88,74.88
SEN_SPI_SCLK  (via drill 0.3)
  Top 0.15: CN3.P50 v44.75,7.25 | v57.88,66 CN1.35
  Bottom 0.15: v44.75,7.25 44.75,25.25 33.5,36.5 33.5,65.38 35.38,67.25 51.5,67.25 52.75,66 v57.88,66
SEN_SYS_!RESET  (via drill 0.3)
  Top 0.15: CN3.P49 v44.25,7.62 | v57.88,67.62 59.75,67.62 59.73,67.6 CN1.31
  Bottom 0.15: v44.25,7.62 44.25,25.25 33.12,36.38 33.12,65.5 35.25,67.62 51.62,67.62 52,67.25 52.5,67.25 52.88,67.62 v57.88,67.62
SEN_T_D0_N  (via drill 0.3)
  Top 0.15: v43.5,43 43.5,42.75 37.75,37 CN3.P36 | v61.12,50 CN1.75
  Bottom 0.15: v43.5,43 44.5,43 50.25,48.75 56.12,48.75 57.5,50.12 61,50.12 v61.12,50
SEN_T_D0_P  (via drill 0.3)
  Top 0.15: CN3.P37 38.25,7.12 38.12,7.25 38.12,36.88 44.12,42.88 v44.12,43.5 | v61.12,50.75 59.48,50.75 CN1.73
  Bottom 0.15: v44.12,43.5 44.5,43.5 50.12,49.12 56,49.12 57.38,50.5 60.88,50.5 v61.12,50.75
SEN_T_D3_N  (via drill 0.3)
  Top 0.15: CN3.P35 37.25,7.12 37.12,7.25 37.12,37.62 43.75,44.25 v44,44.25 | v61.12,52.38 59.45,52.38 CN1.69
  Bottom 0.15: v44,44.25 44,44.5 52.12,52.62 60.88,52.62 v61.12,52.38
SEN_T_D3_P  (via drill 0.3)
  Top 0.15: v43.5,44.75 43.5,44.5 36.75,37.75 CN3.P34 | v61.12,53.25 61.08,53.2 CN1.67
  Bottom 0.15: v43.5,44.75 43.75,44.75 52,53 60.88,53 v61.12,53.25
SEN_T_D6_N  (via drill 0.3)
  Top 0.15: CN3.P30 34.75,39.88 40,45.12 v40,45.38 | v61,58.12 59.55,58.12 CN1.55
  Bottom 0.15: v40,45.38 40.75,45.38 52,56.62 54.62,56.62 56.25,58.25 60.88,58.25 v61,58.12
SEN_T_D6_P  (via drill 0.3)
  Top 0.15: CN3.P31 35.25,7.12 35.12,7.25 35.12,39.75 40.5,45.12 v40.5,45.88 | v61,58.88 60.92,58.8 CN1.53
  Bottom 0.15: v40.5,45.88 40.75,45.88 51.88,57 54.5,57 56.12,58.62 60.75,58.62 v61,58.88
SEN_T_D9_N
  Top 0.15: CN3.P19 29.25,7.12 29.12,7.25 29.12,44.88 44.88,60.62 53.5,60.62 53.75,60.38 55.38,60.38 55.35,60.4 CN1.50
SEN_T_D9_P
  Top 0.15: CN3.P18 28.75,45 44.75,61 53.5,61 53.7,61.2 CN1.48
SEN_T_D12_N
  Top 0.15: CN3.P23 31.25,7.12 31.12,7.25 31.12,43.62 42.5,55 53.75,55 54,54.75 54.98,54.75 CN1.64
SEN_T_D12_P
  Top 0.15: CN3.P22 30.75,43.75 42.38,55.38 53.62,55.38 53.88,55.62 55.25,55.62 55.23,55.6 CN1.62
SEN_T_D15_N
  Top 0.15: CN3.P9 24.25,7.12 24.12,7.25 24.12,49.25 47.5,72.62 53.62,72.62 53.88,72.38 55,72.38 CN1.20
SEN_T_D15_P
  Top 0.15: CN3.P8 23.75,49.38 47.38,73 53.5,73 53.75,73.25 54.98,73.25 CN1.18
SEN_T_D18_N
  Top 0.15: CN3.P12 25.75,47.62 46.5,68.38 52.5,68.38 53.25,67.62 55.38,67.62 55.35,67.6 CN1.32
SEN_T_D18_P  (via drill 0.3)
  Top 0.15: CN3.P13 26.25,7.12 26.12,7.25 26.12,47.5 46.62,68 52.12,68 v52.25,67.88 | v53,68.62 53.23,68.4 CN1.30
  Bottom 0.15: v52.25,67.88 v53,68.62
SEN_T_D21_N
  Top 0.15: CN3.P7 23.25,7.12 23.12,7.25 23.12,50.25 47.88,75 53.58,75 53.77,74.8 CN1.14
SEN_T_D21_P
  Top 0.15: CN3.P6 22.75,50.38 47.75,75.38 53.55,75.38 53.77,75.6 CN1.12
SEN_TDIG0  (via drill 0.3)
  Top 0.15: CN3.P52 v45.75,7.25 | v57.88,63.5 57.98,63.6 CN1.41
  Bottom 0.15: v45.75,7.25 45.75,25.25 34.25,36.75 34.25,65.12 35.62,66.5 51.25,66.5 54.25,63.5 v57.88,63.5
SEN_TDIG1  (via drill 0.3)
  Top 0.15: CN3.P51 v45.25,7.62 | v57.88,65.25 59.75,65.25 59.7,65.2 CN1.37
  Bottom 0.15: v45.25,7.62 45.25,25.25 33.88,36.62 33.88,65.25 35.5,66.88 51.38,66.88 53,65.25 v57.88,65.25
SEN_TEMP1  (via drill 0.3)
  Top 0.15: CN3.P47 v43.25,7.62 | v57.88,70 CN1.25
  Bottom 0.15: v43.25,7.62 43.25,25.25 32.38,36.12 32.38,65.75 35,68.38 51.5,68.38 53.12,70 v57.88,70
SEN_TEMP_SPI_!CS  (via drill 0.3)
  Top 0.15: CN3.P53 v46.25,7.62 | v57.88,62.75 57.92,62.8 CN1.43
  Bottom 0.15: v46.25,7.62 46.25,25.25 34.62,36.88 34.62,65 35.75,66.12 51.12,66.12 54.5,62.75 v57.88,62.75
SEN_TEXP0  (via drill 0.3)
  Top 0.15: CN3.P48 v43.75,7.25 | v57.88,68.38 59.4,68.38 CN1.29
  Bottom 0.15: v43.75,7.25 43.75,25.25 32.75,36.25 32.75,65.62 35.12,68 51.62,68 52.75,69.12 53.25,69.12 54,68.38 v57.88,68.38
SYS_PWR_2V5  (via drill 0.3, 0.5)
  Top 0.15: C36.2 R6.2 12.62,102.5 v10,105.12
  Top 0.2: v46.75,5.38 CN3.P54 v46.75,7.25
  Top 0.5: CN1.78 CN1.80 56.6,48.4 v56.62,48.38 | CN2.78 CN2.80 v12.12,48.4 | CN2.79 13.52,48.4 v13.5,48.38 | CN1.79 58.02,48.4 v58,48.38 | C7.2 L3.2 | C7.2 v7.5,105.12 | C7.2 v10,105.12
  pour PWR2 (rank 6): 15,35 55,35 55,85 15,85
  pour PWR (rank 6): 0,0 70,0 70,120 0,120
SYS_PWR_5V  (via drill 0.3, 0.5)
  Top 0.15: R19.2 62.5,22.88 59.12,26.25 v59,26.25 | U1.5 5.88,82.9 C1.1 v5.88,84.88 | CN2.12 8.4,75.6 R2.2
  Top 0.2: v48.75,7.25 CN3.P58 v48.75,5.38 | v49.25,5.75 CN3.P59 v49.25,7.62 | v49.75,7.25 CN3.P60 v49.75,5.38
  Top 0.5: CN2.58 12.07,57.2 v12.12,57.25 | CN2.60 12.1,56.4 v12.12,56.38 | CN2.57 13.55,57.2 v13.5,57.25 | CN2.59 13.52,56.4 v13.5,56.38 | CN1.58 56.45,57.2 v56.5,57.25 | CN1.60 56.48,56.4 v56.5,56.38 | CN1.59 58.02,56.4 v58,56.38 | CN1.57 58.05,57.2 v58,57.25 | CN2.12 12.1,75.6 v12.12,75.62 | C34.2 59,28.5 | C35.2 59,28.5 | L2.2 57.97,28.48 v58,28.5 59,28.5 | C35.2 v60,29.5 | C34.2 v60,27.5 | 59,28.5 v60,28.5 | C34.2 v58,27.5 | C35.2 v59,30.75 | C34.2 v59,26.25 | U5.5 55.38,106.03 L1.1 C8.2 | C8.2 v57.38,109.88 | C8.2 v57.38,107.88 | C35.2 v58,29.5 | C13.2 7.8,94.58 U7.4 | C5.2 17.8,94.58 U3.4 | C5.2 v17,94.12 | C5.2 v19.5,94.12 | C13.2 v7,94.12 | C13.2 v9.5,94.12
  PWR 0.15: v49.75,5.38 49.62,5.38 v49.25,5.75 | v49.75,7.25 49.62,7.25 v49.25,7.62 | v5.88,84.88 12.12,78.62 v12.12,75.62
  PWR 0.25: 49.25,5.38 v48.75,5.38 | v48.75,5.38 49,5.12 49.5,5.12 v49.75,5.38 49.38,5.75 v49.25,5.75 49.12,5.75 v48.75,5.38 | v49.25,7.62 49.12,7.62 v48.75,7.25 49.25,6.75 v49.75,7.25 49.38,7.62 v49.25,7.62
  PWR 1: v12.12,57.25 v12.12,56.38 v13.5,56.38 | v13.5,56.38 v13.5,57.25 | 49.25,5.38 v49.25,5.75 49.25,6.75 v49.25,7.62 49.25,11.88 54.38,17 54.38,21.12 59,25.75 v59,26.25 | v56.5,56.38 54.12,56.38 49,51.25 49,38.5 v58,29.5 | v56.5,56.38 v56.5,57.25 | v56.5,56.38 v58,56.38 v58,57.25 | v57.38,109.88 v57.38,107.88 54.38,107.88 46.75,100.25 46.75,36.62 54.88,28.5 v58,28.5 | v19.5,94.12 15.88,94.12 | 15.88,94.12 v7,94.12 | v13.5,56.38 15.38,54.5 15.38,52.25 23,44.62 32.25,44.62 | 15.88,94.12 15.88,85.12 18.69,82.31 | 18.69,82.31 32.25,68.75 32.25,44.62 | v12.12,75.62 18.69,82.19 18.69,82.31 | v59,30.75 58,29.75 v58,29.5 | v59,30.75 60,29.75 v60,28.5 | v59,30.75 C34.2 | 59.88,27.5 59.88,27.25 | v59,26.25 59,26.38 59.88,27.25 | v58,28.5 v60,28.5 | v60,27.5 59.88,27.5 | 59.88,27.5 C34.2 | C34.2 v58,27.5 | v58,27.5 v58,28.5 | v58,28.5 v58,29.5 | v60,29.5 v60,28.5 | v60,28.5 v60,27.5 | v58,27.5 57.12,26.62 52.38,26.62 34.38,44.62 32.25,44.62 | v58,27.5 59,26.5 | v60,27.5 59,26.5 | 59,26.5 v59,26.25 | 59.88,27.25 60,27.38 v60,27.5
SYS_VCCO_EN
  Top 0.15: U1.1 3.07,84.7 5.5,87.12 7.5,87.12 11.88,91.5 11.88,94.5 11.88,98.62 11.62,98.88 9.9,98.88 9.7,98.67 U7.1